# EAGLE schematic tex (EAGLE 7.7.0)

## Sheet 1 of 7: Overview
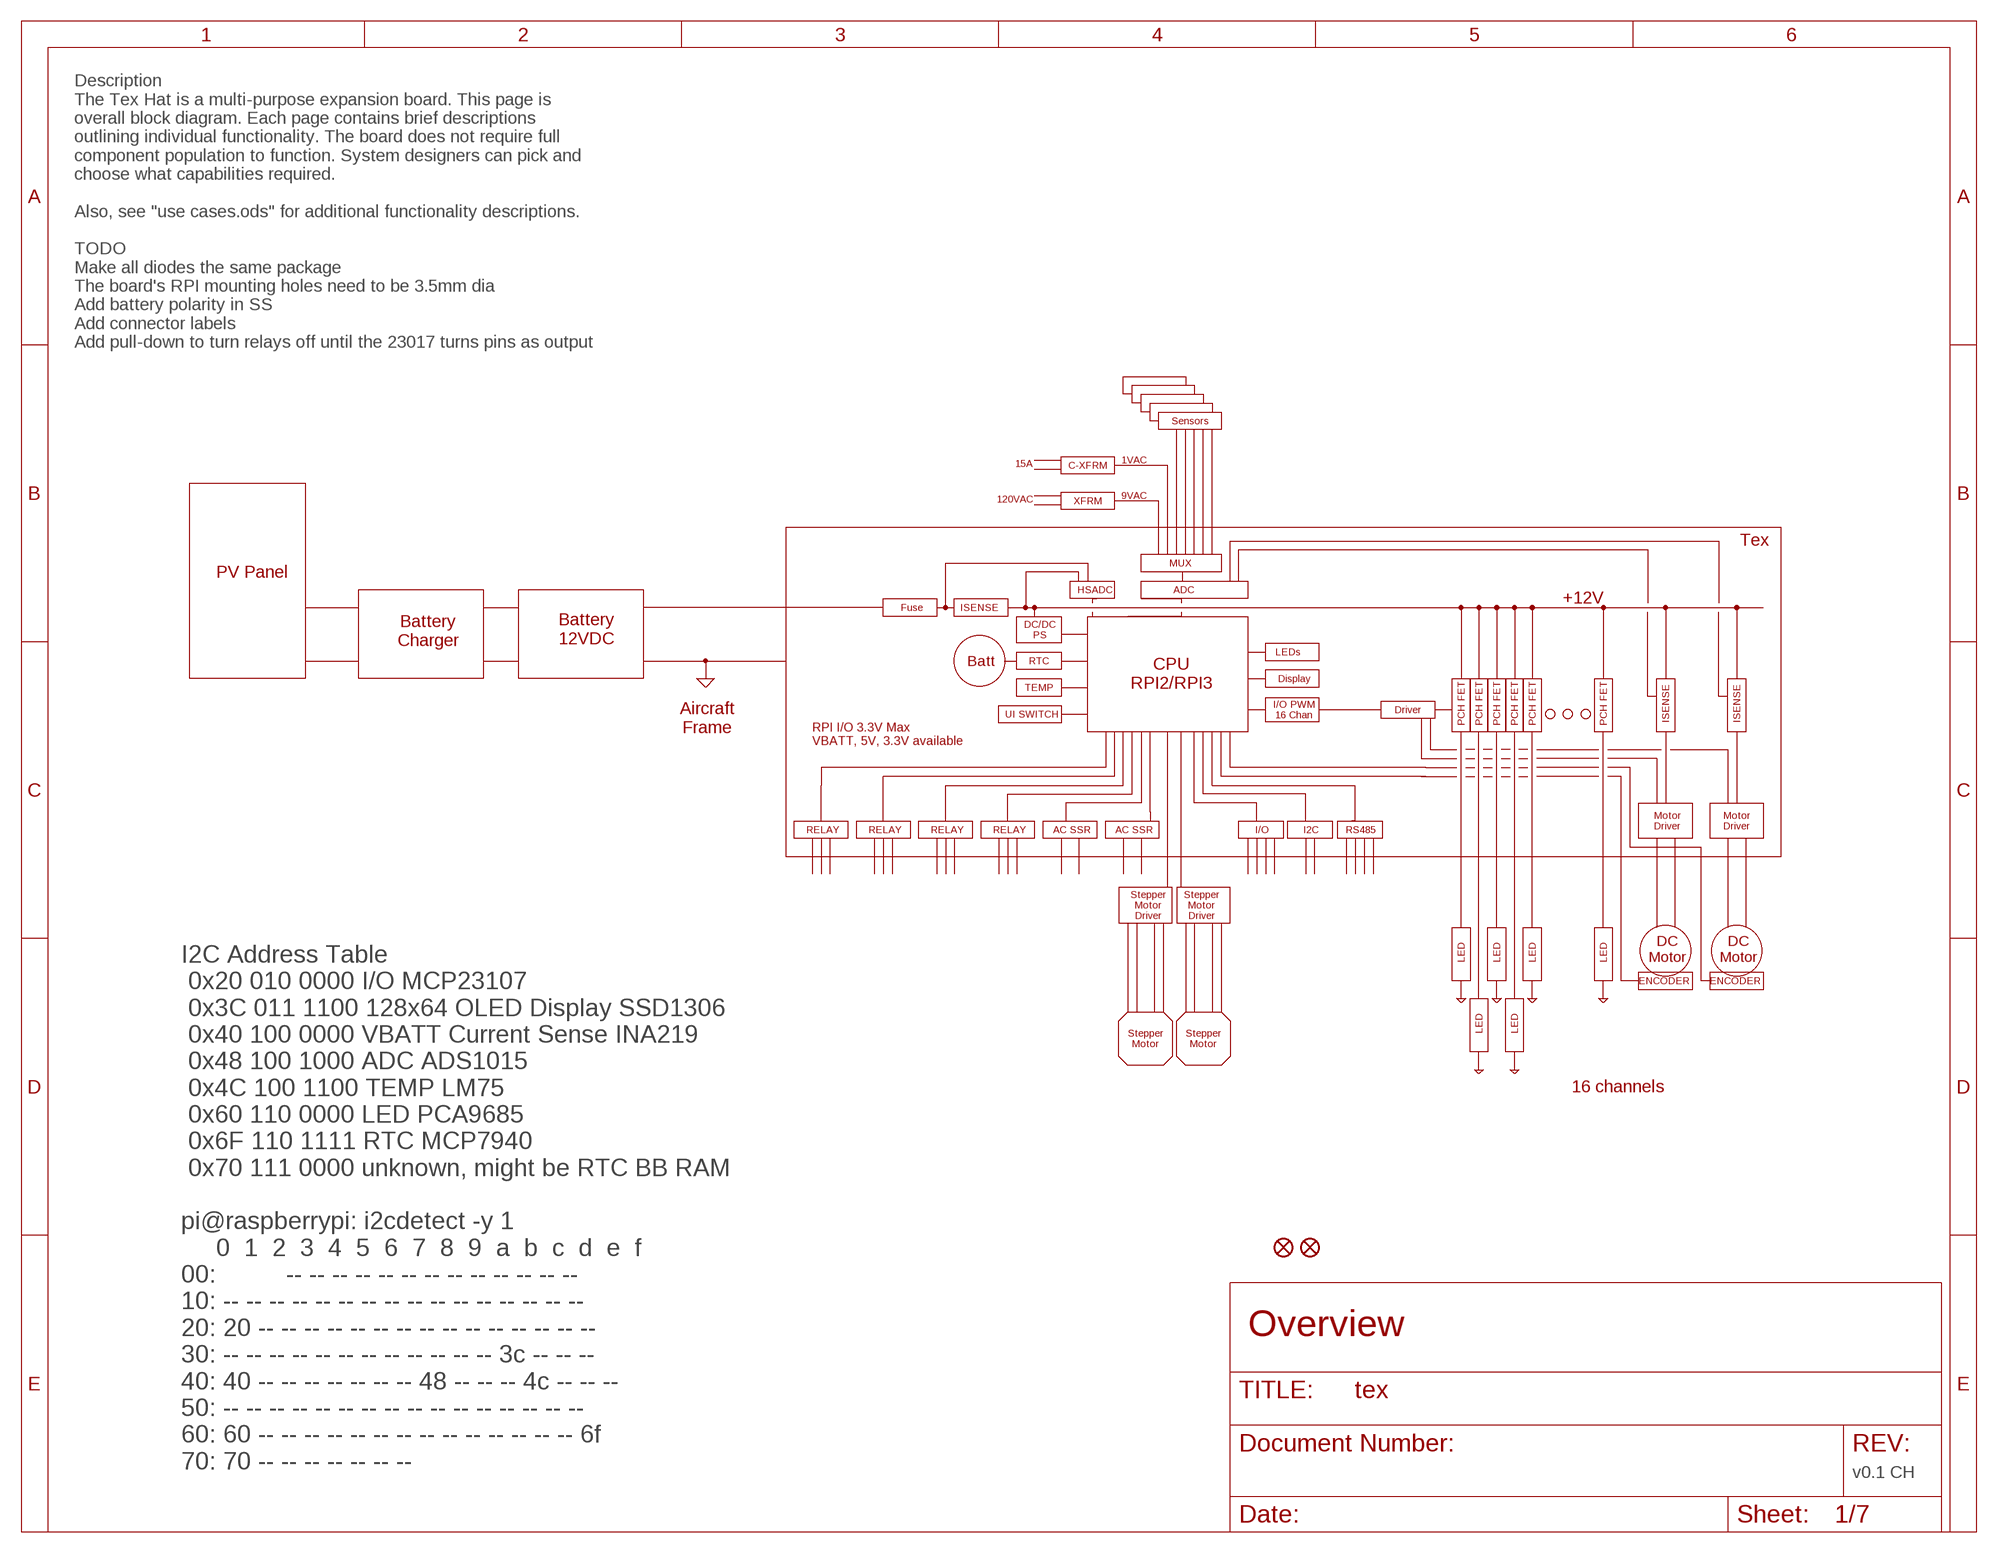
[diagram p0: schematic, sheet 1]

### Parts
JP1  FIDUCIALUFIDUCIAL  [MICRO-FIDUCIAL]
JP3  FIDUCIALUFIDUCIAL  [MICRO-FIDUCIAL]

### Notes on the sheet
- Description
  The Tex Hat is a multi-purpose expansion board. This page is
  overall block diagram. Each page contains brief descriptions 
  outlining individual functionality. The board does not require full 
  component population to function. System designers can pick and 
  choose what capabilities required.
  
  Also, see "use cases.ods" for additional functionality descriptions.
  
  TODO
  Make all diodes the same package
  The board's RPI mounting holes need to be 3.5mm dia
  Add battery polarity in SS
  Add connector labels
  Add pull-down to turn relays off until the 23017 turns pins as output
- Sensors
- 1VAC
- 15A | C-XFRM
- 9VAC
- 120VAC | XFRM
- Tex
- MUX
- PV Panel
- HSADC | ADC
- +12V
- Fuse | ISENSE
- Battery
  12VDC
- DC/DC
  PS
- Battery
  Charger
- LEDs
- Batt | RTC
- CPU
  RPI2/RPI3
- Display
- TEMP
- PCH FET | PCH FET | PCH FET | PCH FET | PCH FET | PCH FET | ISENSE | ISENSE
- I/O PWM
  16 Chan
- Driver
- UI SWITCH
- Aircraft
  Frame
- RPI I/O 3.3V Max
  VBATT, 5V, 3.3V available
- Motor
  Driver
- Motor
  Driver
- RELAY | RELAY | RELAY | RELAY | AC SSR | AC SSR | I/O | I2C | RS485
- Stepper
  Motor
  Driver
- Stepper
  Motor
  Driver
- I2C Address Table
   0x20 010 0000 I/O MCP23107
   0x3C 011 1100 128x64 OLED Display SSD1306
   0x40 100 0000 VBATT Current Sense INA219
   0x48 100 1000 ADC ADS1015
   0x4C 100 1100 TEMP LM75
   0x60 110 0000 LED PCA9685
   0x6F 110 1111 RTC MCP7940
   0x70 111 0000 unknown, might be RTC BB RAM
   
  pi@raspberrypi: i2cdetect -y 1
       0  1  2  3  4  5  6  7  8  9  a  b  c  d  e  f
  00:          -- -- -- -- -- -- -- -- -- -- -- -- -- 
  10: -- -- -- -- -- -- -- -- -- -- -- -- -- -- -- -- 
  20: 20 -- -- -- -- -- -- -- -- -- -- -- -- -- -- -- 
  30: -- -- -- -- -- -- -- -- -- -- -- -- 3c -- -- -- 
  40: 40 -- -- -- -- -- -- -- 48 -- -- -- 4c -- -- -- 
  50: -- -- -- -- -- -- -- -- -- -- -- -- -- -- -- -- 
  60: 60 -- -- -- -- -- -- -- -- -- -- -- -- -- -- 6f 
  70: 70 -- -- -- -- -- -- --
- DC
  Motor
- DC
  Motor
- LED | LED | LED | LED
- ENCODER | ENCODER
- LED | LED
- Stepper
  Motor
- Stepper
  Motor
- 16 channels
- v0.1 CH

## Sheet 2 of 7: CPU
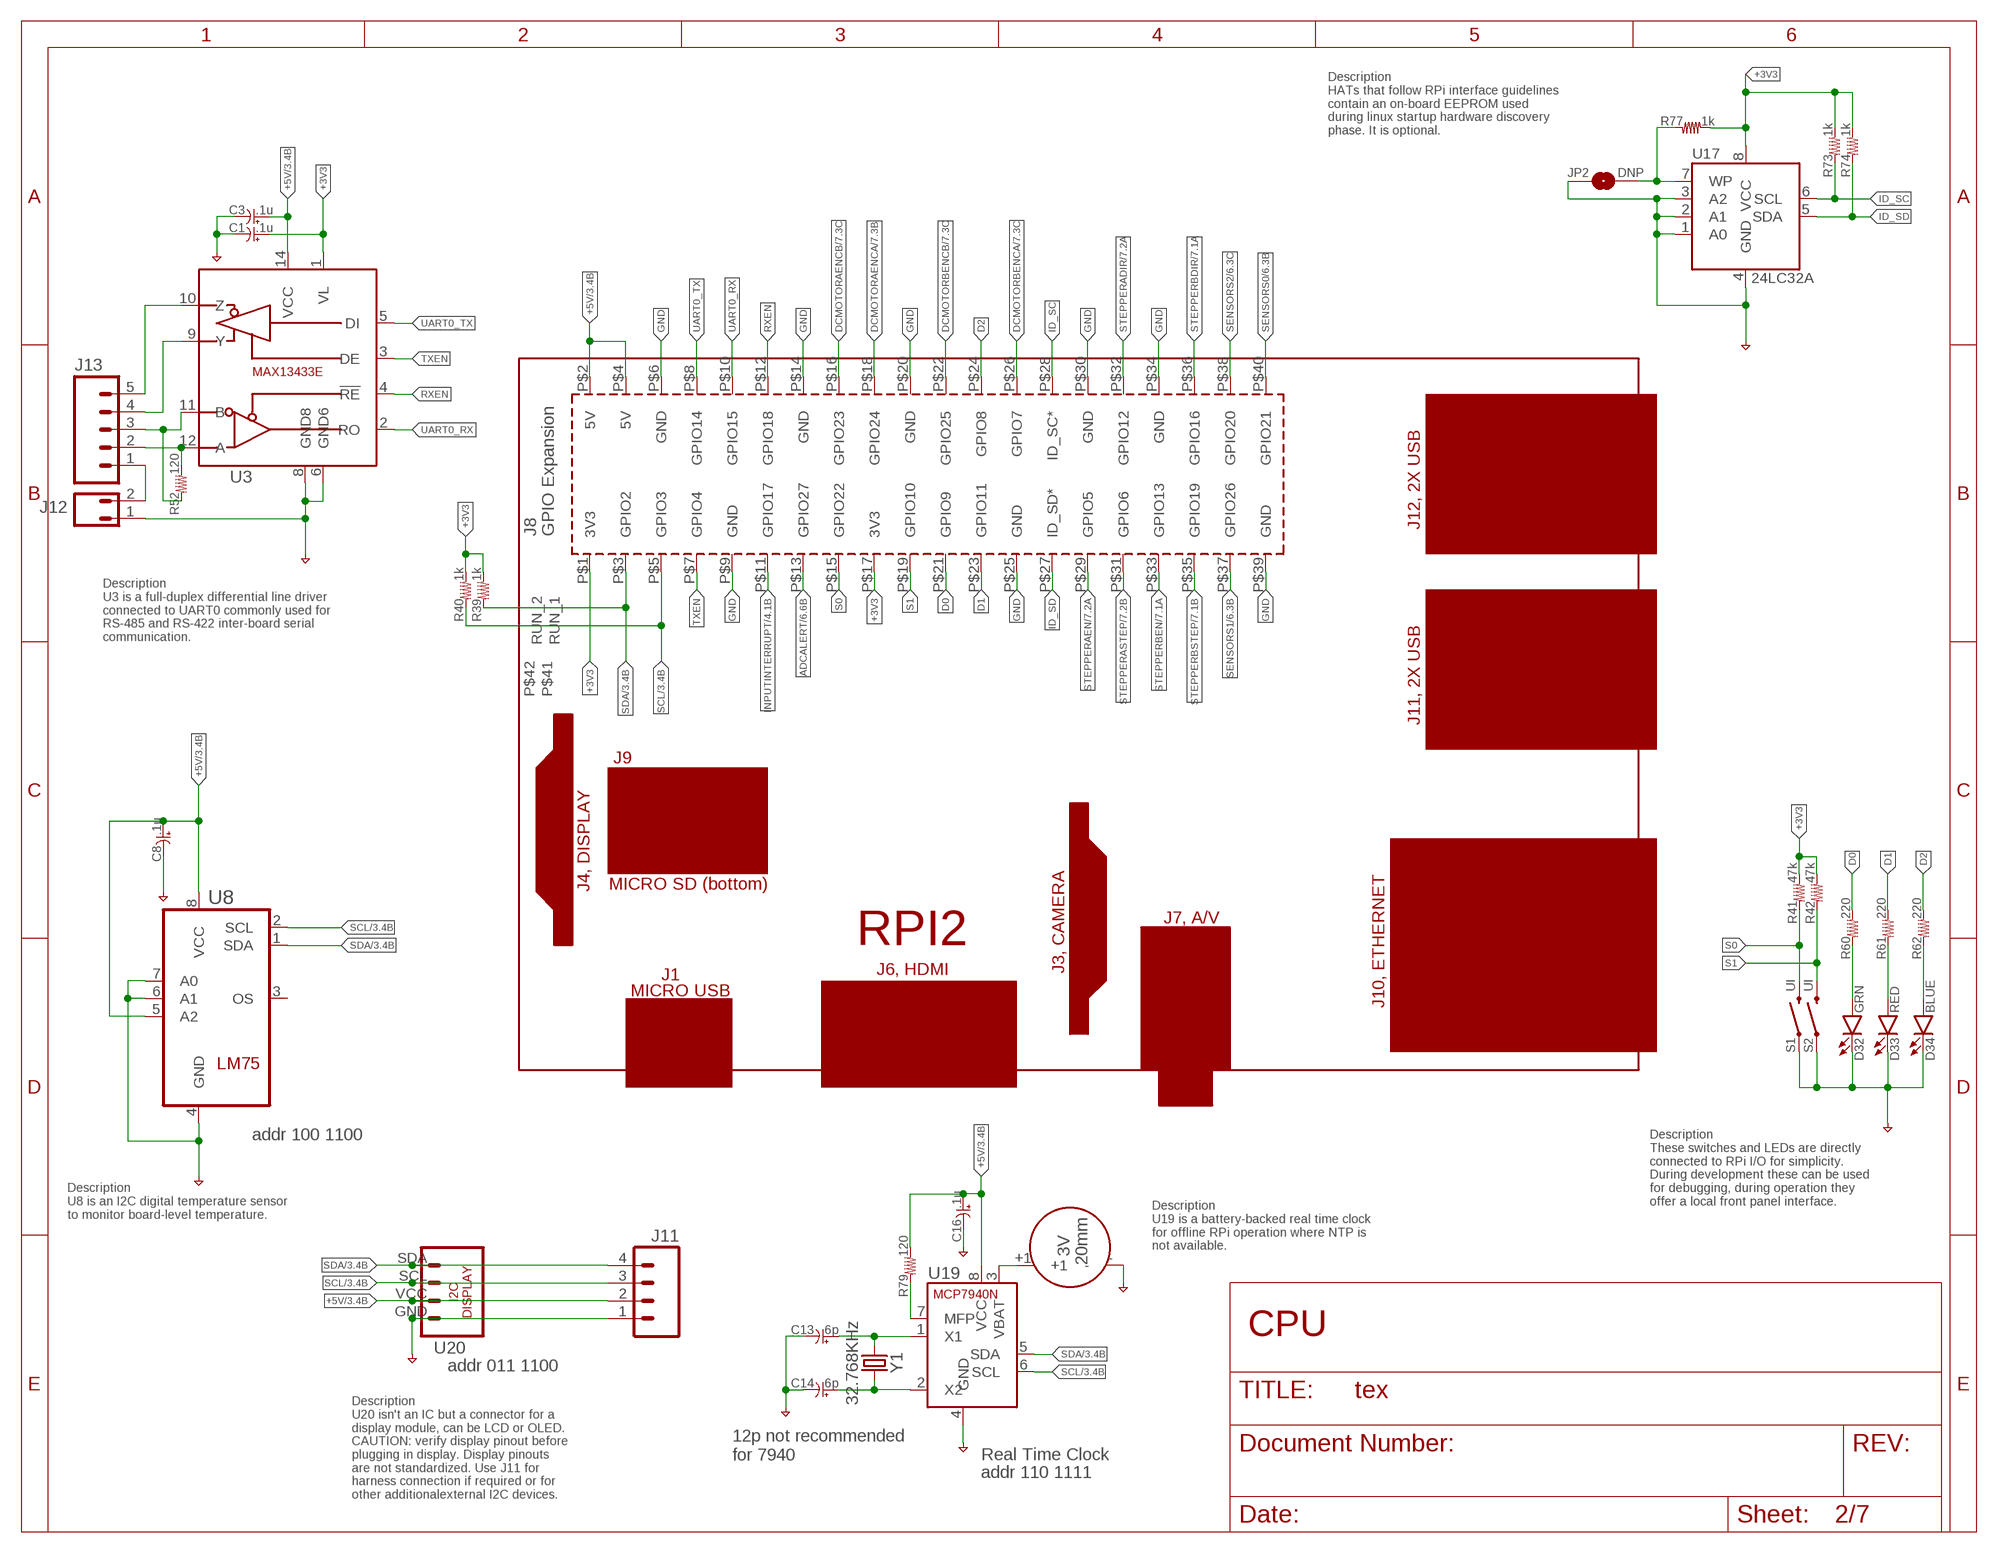
[diagram p1: schematic, sheet 2]

### Parts
B1  CR2032  CONN-COINBATTERYHOLDER-20MM  [BAT-HLD-001]
C1  .1u  C-0603  [C0603]
C3  .1u  C-0603  [C0603]
C8  .1u  C-0603  [C0603]
C13  6p  C-0603  [C0603]
C14  6p  C-0603  [C0603]
C16  .1u  C-0603  [C0603]
D32  GRN  LED-0603  [LED0603]
D33  RED  LED-0603  [LED0603]
D34  BLUE  LED-0603  [LED0603]
J11  CONN-04-0.1  [1X04]
J12  CONN-02-0.1  [1X02]
J13  CONN-05-PLUGIN-SCREW  [CONN-3.81MM-KF2EDG-5]
JP2  DNP  JUMPER-PAD-2-NO  [PAD-JUMPER-2-NO_NO_SILK]
PCB1  BOARD-RPI2  [BOARD-RPI2]
R39  1k  R-0603  [R0603]
R40  1k  R-0603  [R0603]
R41  47k  R-0603  [R0603]
R42  47k  R-0603  [R0603]
R52  120  R-0603  [R0603]
R60  220  R-0603  [R0603]
R61  220  R-0603  [R0603]
R62  220  R-0603  [R0603]
R73  1k  R-0603  [R0603]
R74  1k  R-0603  [R0603]
R77  1k  R-0603  [R0603]
R79  120  R-0603  [R0603]
S1  UI  SWITCH-PUSHBUTTON-6MMX3.5MM  [TACTILE-SWITCH-6MMX3.5MM]
S2  UI  SWITCH-PUSHBUTTON-6MMX3.5MM  [TACTILE-SWITCH-6MMX3.5MM]
U3  MAX13433E  COMM-MAX13433E  [SO14]
U8  LM75  SENSOR-TEMP-LM75-SO08  [SO08]
U17  24LC32A  MEMORY-EEPROM-SO08  [SO08]
U19  MCP7940N  RTC-MCP7940N  [SO08]
U20  DISP-I2C-4PIN  [DISP-I2C-4PIN-0.96]
Y1  32.768KHz  CRYSTAL32-SMDABS25  [ABS25]

### Nets
+3V3: C1.1 PCB1.P$1(3V3) PCB1.P$17(3V3) R39.2 R40.2 R41.2 R42.2 R73.2 R74.2 R77.2 U3.1(VL) U17.8(VCC)
+5V: C3.1 C8.1 C16.1 J11.2 PCB1.P$2(5V) PCB1.P$4(5V) R79.2 U3.14(VCC) U8.5(A2) U8.8(VCC) U19.8(VCC) U20.VCC ; also sheet 3,4,5,6,7
ADCALERT: PCB1.P$13(GPIO27) ; also sheet 6
D0: PCB1.P$21(GPIO9) R60.2
D1: PCB1.P$23(GPIO11) R61.2
D2: PCB1.P$24(GPIO8) R62.2
DCMOTORAENCA: PCB1.P$18(GPIO24) ; also sheet 7
DCMOTORAENCB: PCB1.P$16(GPIO23) ; also sheet 7
DCMOTORBENCA: PCB1.P$26(GPIO7) ; also sheet 7
DCMOTORBENCB: PCB1.P$22(GPIO25) ; also sheet 7
GND: B1.- C1.2 C3.2 C8.2 C13.2 C14.2 C16.2 D32.C D33.C D34.C J11.1 J12.1 JP2.1 PCB1.P$6(GND) PCB1.P$9(GND) PCB1.P$14(GND) PCB1.P$20(GND) PCB1.P$25(GND) PCB1.P$30(GND) PCB1.P$34(GND) PCB1.P$39(GND) S1.P$1 S2.P$1 U3.6(GND6) U3.8(GND8) U8.4(GND) U8.6(A1) U8.7(A0) U17.1(A0) U17.2(A1) U17.3(A2) U17.4(GND) U19.4(GND) U20.GND ; also sheet 3,4,5,7
ID_SC: PCB1.P$28(ID_SC*) R73.1 U17.6(SCL)
ID_SD: PCB1.P$27(ID_SD*) R74.1 U17.5(SDA)
INPUTINTERRUPT: PCB1.P$11(GPIO17) ; also sheet 4
N$3: C13.1 U19.1(X1) Y1.1
N$5: C14.1 U19.2(X2) Y1.4
N$13: J13.2 R52.2 U3.12(A)
N$14: J13.3 R52.1 U3.11(B)
N$15: J13.4 U3.9(Y)
N$16: J13.5 U3.10(Z)
N$17: J12.2 J13.1
N$29: D32.A R60.1
N$30: D33.A R61.1
N$31: D34.A R62.1
N$104: JP2.2 R77.1 U17.7(WP)
N$118: B1.+1 U19.3(VBAT)
N$192: R79.1 U19.7(MFP)
RXEN: PCB1.P$12(GPIO18) U3.4(!RE)
S0: PCB1.P$15(GPIO22) R41.1 S1.P$2
S1: PCB1.P$19(GPIO10) R42.1 S2.P$2
SCL: J11.3 PCB1.P$5(GPIO3) R40.1 U8.2(SCL) U19.6(SCL) U20.SCL ; also sheet 3,4,5,6
SDA: J11.4 PCB1.P$3(GPIO2) R39.1 U8.1(SDA) U19.5(SDA) U20.SDA ; also sheet 3,4,5,6
SENSORS0: PCB1.P$40(GPIO21) ; also sheet 6
SENSORS1: PCB1.P$37(GPIO26) ; also sheet 6
SENSORS2: PCB1.P$38(GPIO20) ; also sheet 6
STEPPERADIR: PCB1.P$32(GPIO12) ; also sheet 7
STEPPERAEN: PCB1.P$29(GPIO5) ; also sheet 7
STEPPERASTEP: PCB1.P$31(GPIO6) ; also sheet 7
STEPPERBDIR: PCB1.P$36(GPIO16) ; also sheet 7
STEPPERBEN: PCB1.P$33(GPIO13) ; also sheet 7
STEPPERBSTEP: PCB1.P$35(GPIO19) ; also sheet 7
TXEN: PCB1.P$7(GPIO4) U3.3(DE)
UART0_RX: PCB1.P$10(GPIO15) U3.2(RO)
UART0_TX: PCB1.P$8(GPIO14) U3.5(DI)
Unconnected: PCB1.P$41(RUN_1) PCB1.P$42(RUN_2) U8.3(OS)

### Notes on the sheet
- Description
  HATs that follow RPi interface guidelines 
  contain an on-board EEPROM used 
  during linux startup hardware discovery 
  phase. It is optional.
- Description
  U3 is a full-duplex differential line driver 
  connected to UART0 commonly used for 
  RS-485 and RS-422 inter-board serial 
  communication.
- Description
  These switches and LEDs are directly 
  connected to RPi I/O for simplicity. 
  During development these can be used 
  for debugging, during operation they 
  offer a local front panel interface.
- addr 100 1100
- Description
  U8 is an I2C digital temperature sensor 
  to monitor board-level temperature.
- Description
  U19 is a battery-backed real time clock 
  for offline RPi operation where NTP is
  not available.
- addr 011 1100
- Description
  U20 isn't an IC but a connector for a
  display module, can be LCD or OLED. 
  CAUTION: verify display pinout before 
  plugging in display. Display pinouts
  are not standardized. Use J11 for 
  harness connection if required or for
  other additionalexternal I2C devices.
- 12p not recommended
  for 7940
- Real Time Clock
- addr 110 1111

## Sheet 3 of 7: Power
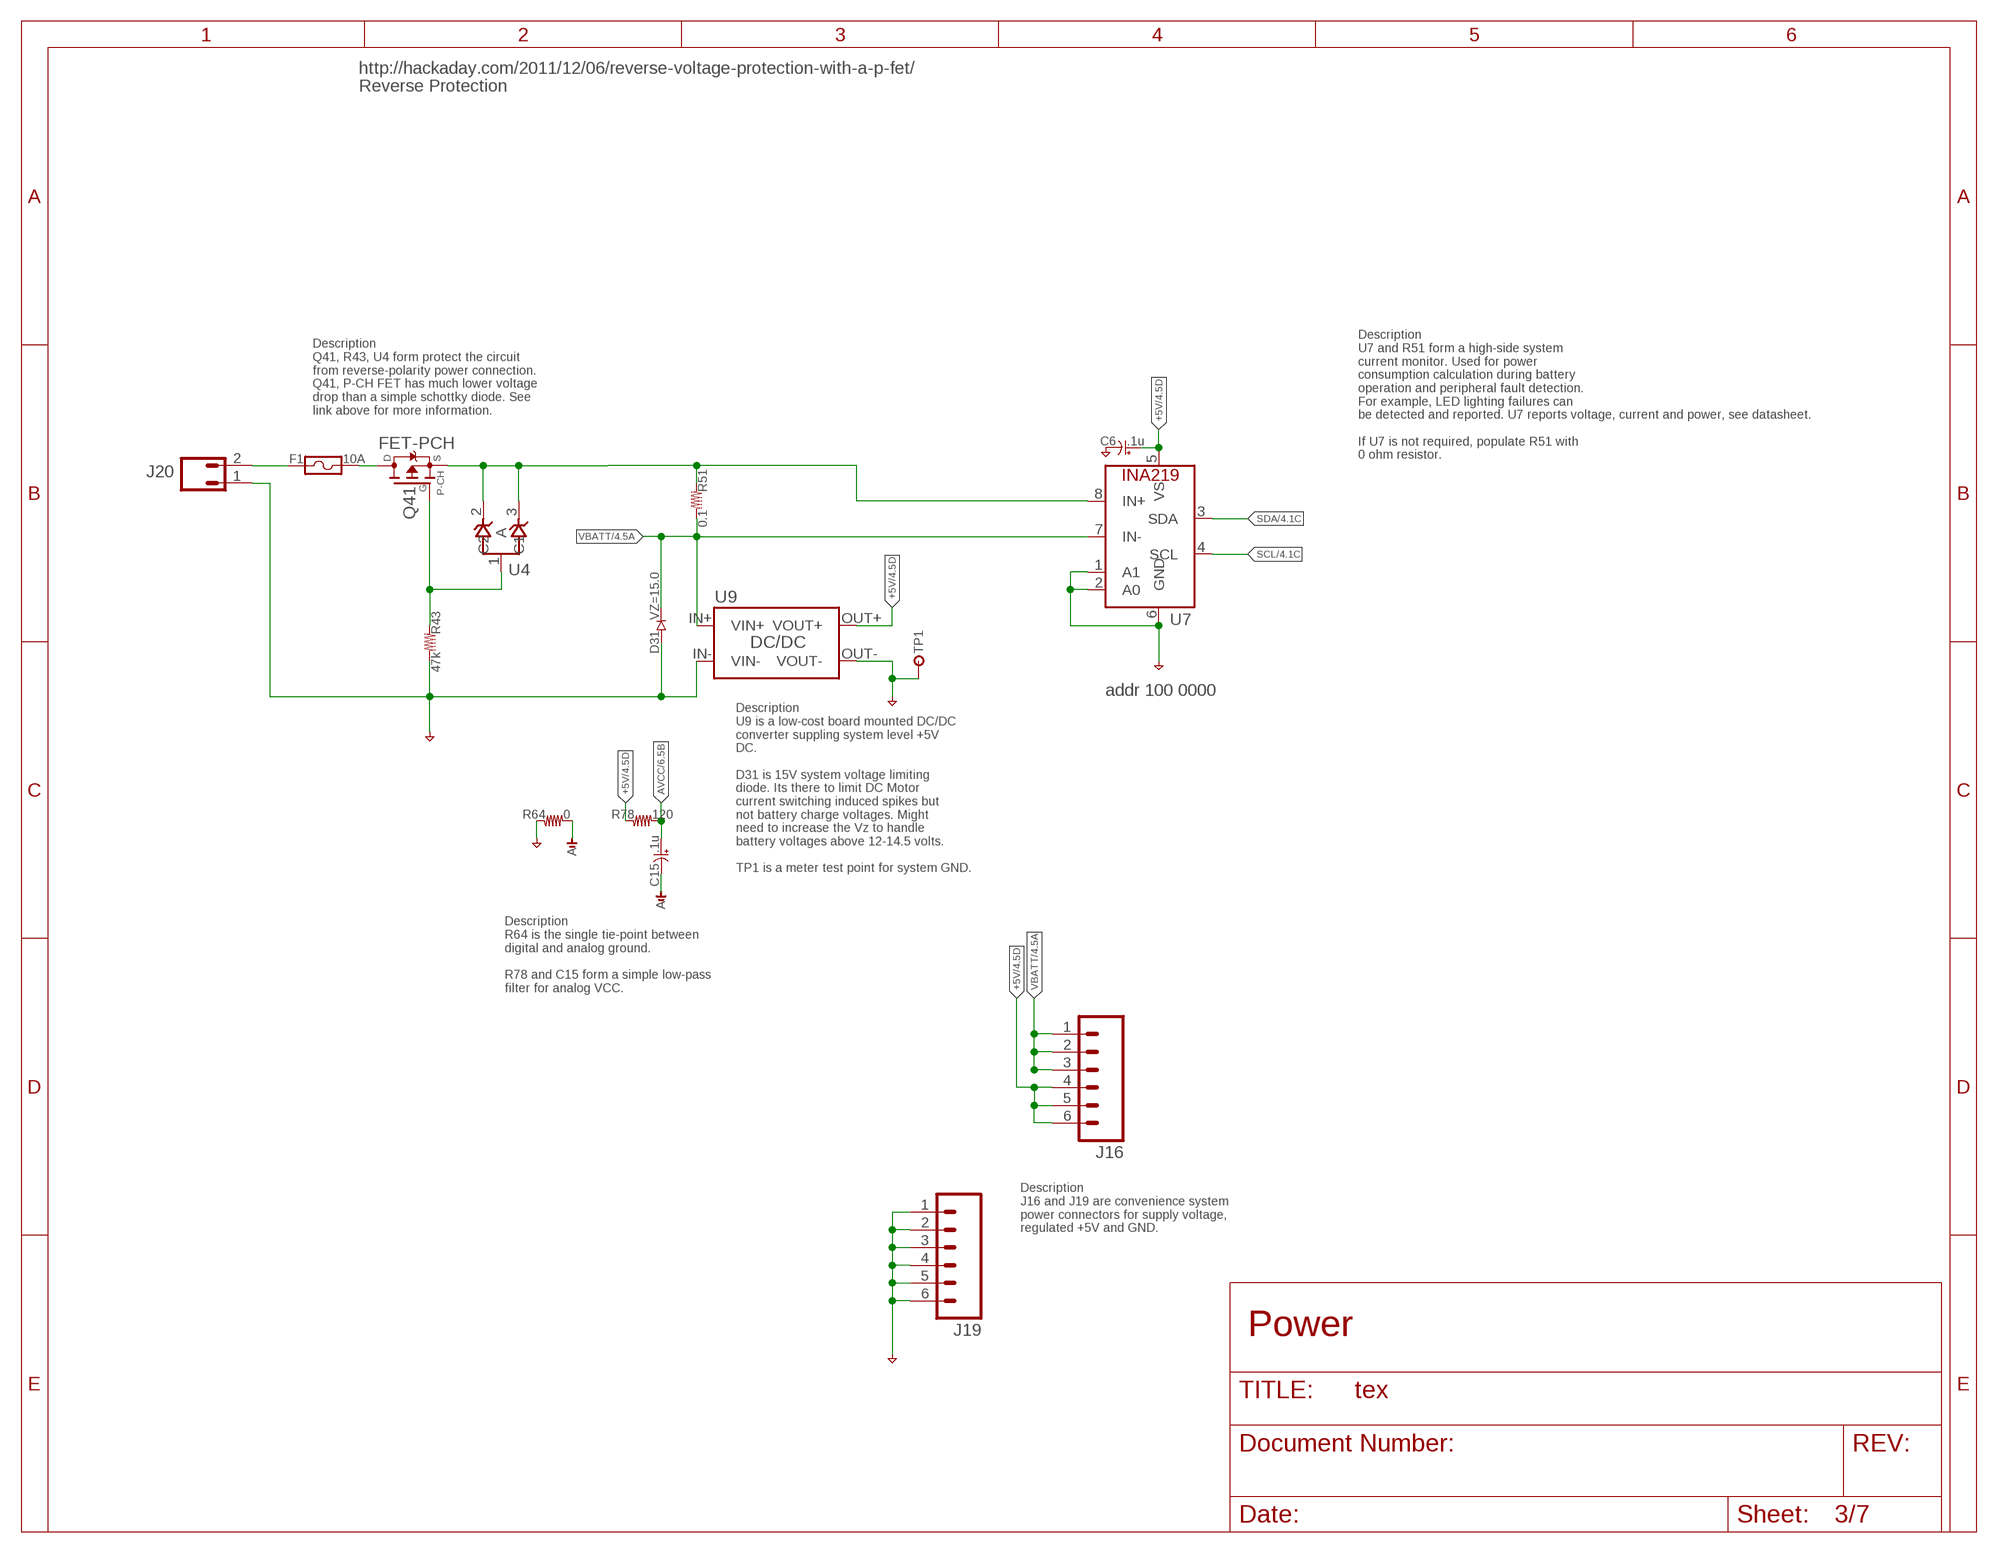
[diagram p2: schematic, sheet 3]

### Parts
C6  .1u  C-0603  [C0603]
C15  .1u  C-0603  [C0603]
D31  VZ=15.0  DIODE-SMA  [DO-214AC(SMA)]
F1  10A  FUSE-HOLDER-3557-2  [3557-2]
J16  CONN-06-PLUGIN-SCREW  [CONN-3.81MM-KF2EDG-6]
J19  CONN-06-PLUGIN-SCREW  [CONN-3.81MM-KF2EDG-6]
J20  CONN-02-6.35MM  [CONN-OSTT702]
Q41  FET-PCH  FET-PCHTO252  [TO252]
R43  47k  R-0603  [R0603]
R51  0.1  R-1210  [R1210]
R64  0  R-0603  [R0603]
R78  120  R-0603  [R0603]
TP1  TESTPOINTTHRU  [TPTHRU]
U4  AZ23C5V1  AZ23CXXX  [SOT-23]
U7  INA219  ADC-INA219-SOIC8  [SOIC8]
U9  DCDC-CONVERTER-LM2577-BOARD  [DCDC-LM2577-BOARD]

### Nets
+5V: C6.1 J16.4 J16.5 J16.6 R78.1 U7.5(VS) U9.OUT+(VOUT+) ; also sheet 2,4,5,6,7
AGND: C15.2 R64.2 ; also sheet 6,7
AVCC: C15.1 R78.2 ; also sheet 6,7
GND: C6.2 D31.A J19.1 J19.2 J19.3 J19.4 J19.5 J19.6 J20.1 R43.2 R64.1 TP1.1 U7.1(A1) U7.2(A0) U7.6(GND) U9.IN-(VIN-) U9.OUT-(VOUT-) ; also sheet 2,4,5,7
N$4: Q41.1(G) R43.1 U4.1(A)
N$101: F1.1@1 F1.1@2 J20.2
N$194: F1.2@1 F1.2@2 Q41.3(D)
SCL: U7.4(SCL) ; also sheet 2,4,5,6
SDA: U7.3(SDA) ; also sheet 2,4,5,6
VBATT: D31.C J16.1 J16.2 J16.3 R51.2 U7.7(IN-) U9.IN+(VIN+) ; also sheet 4,5,7
VBATTISENSE: Q41.2(S) R51.1 U4.2(C2) U4.3(C1) U7.8(IN+)

### Notes on the sheet
- http://hackaday.com/2011/12/06/reverse-voltage-protection-with-a-p-fet/
- Reverse Protection
- Description
  U7 and R51 form a high-side system 
  current monitor. Used for power 
  consumption calculation during battery 
  operation and peripheral fault detection. 
  For example, LED lighting failures can 
  be detected and reported. U7 reports voltage, current and power, see datasheet.
  
  If U7 is not required, populate R51 with 
  0 ohm resistor.
- Description
  Q41, R43, U4 form protect the circuit 
  from reverse-polarity power connection. 
  Q41, P-CH FET has much lower voltage 
  drop than a simple schottky diode. See
  link above for more information.
- U4
- U7
- addr 100 0000
- Description
  U9 is a low-cost board mounted DC/DC 
  converter suppling system level +5V 
  DC.
  
  D31 is 15V system voltage limiting 
  diode. Its there to limit DC Motor 
  current switching induced spikes but 
  not battery charge voltages. Might 
  need to increase the Vz to handle 
  battery voltages above 12-14.5 volts.
   
  TP1 is a meter test point for system GND.
- Description
  R64 is the single tie-point between 
  digital and analog ground.
  
  R78 and C15 form a simple low-pass 
  filter for analog VCC.
- Description
  J16 and J19 are convenience system 
  power connectors for supply voltage, 
  regulated +5V and GND.

## Sheet 4 of 7: RELAY
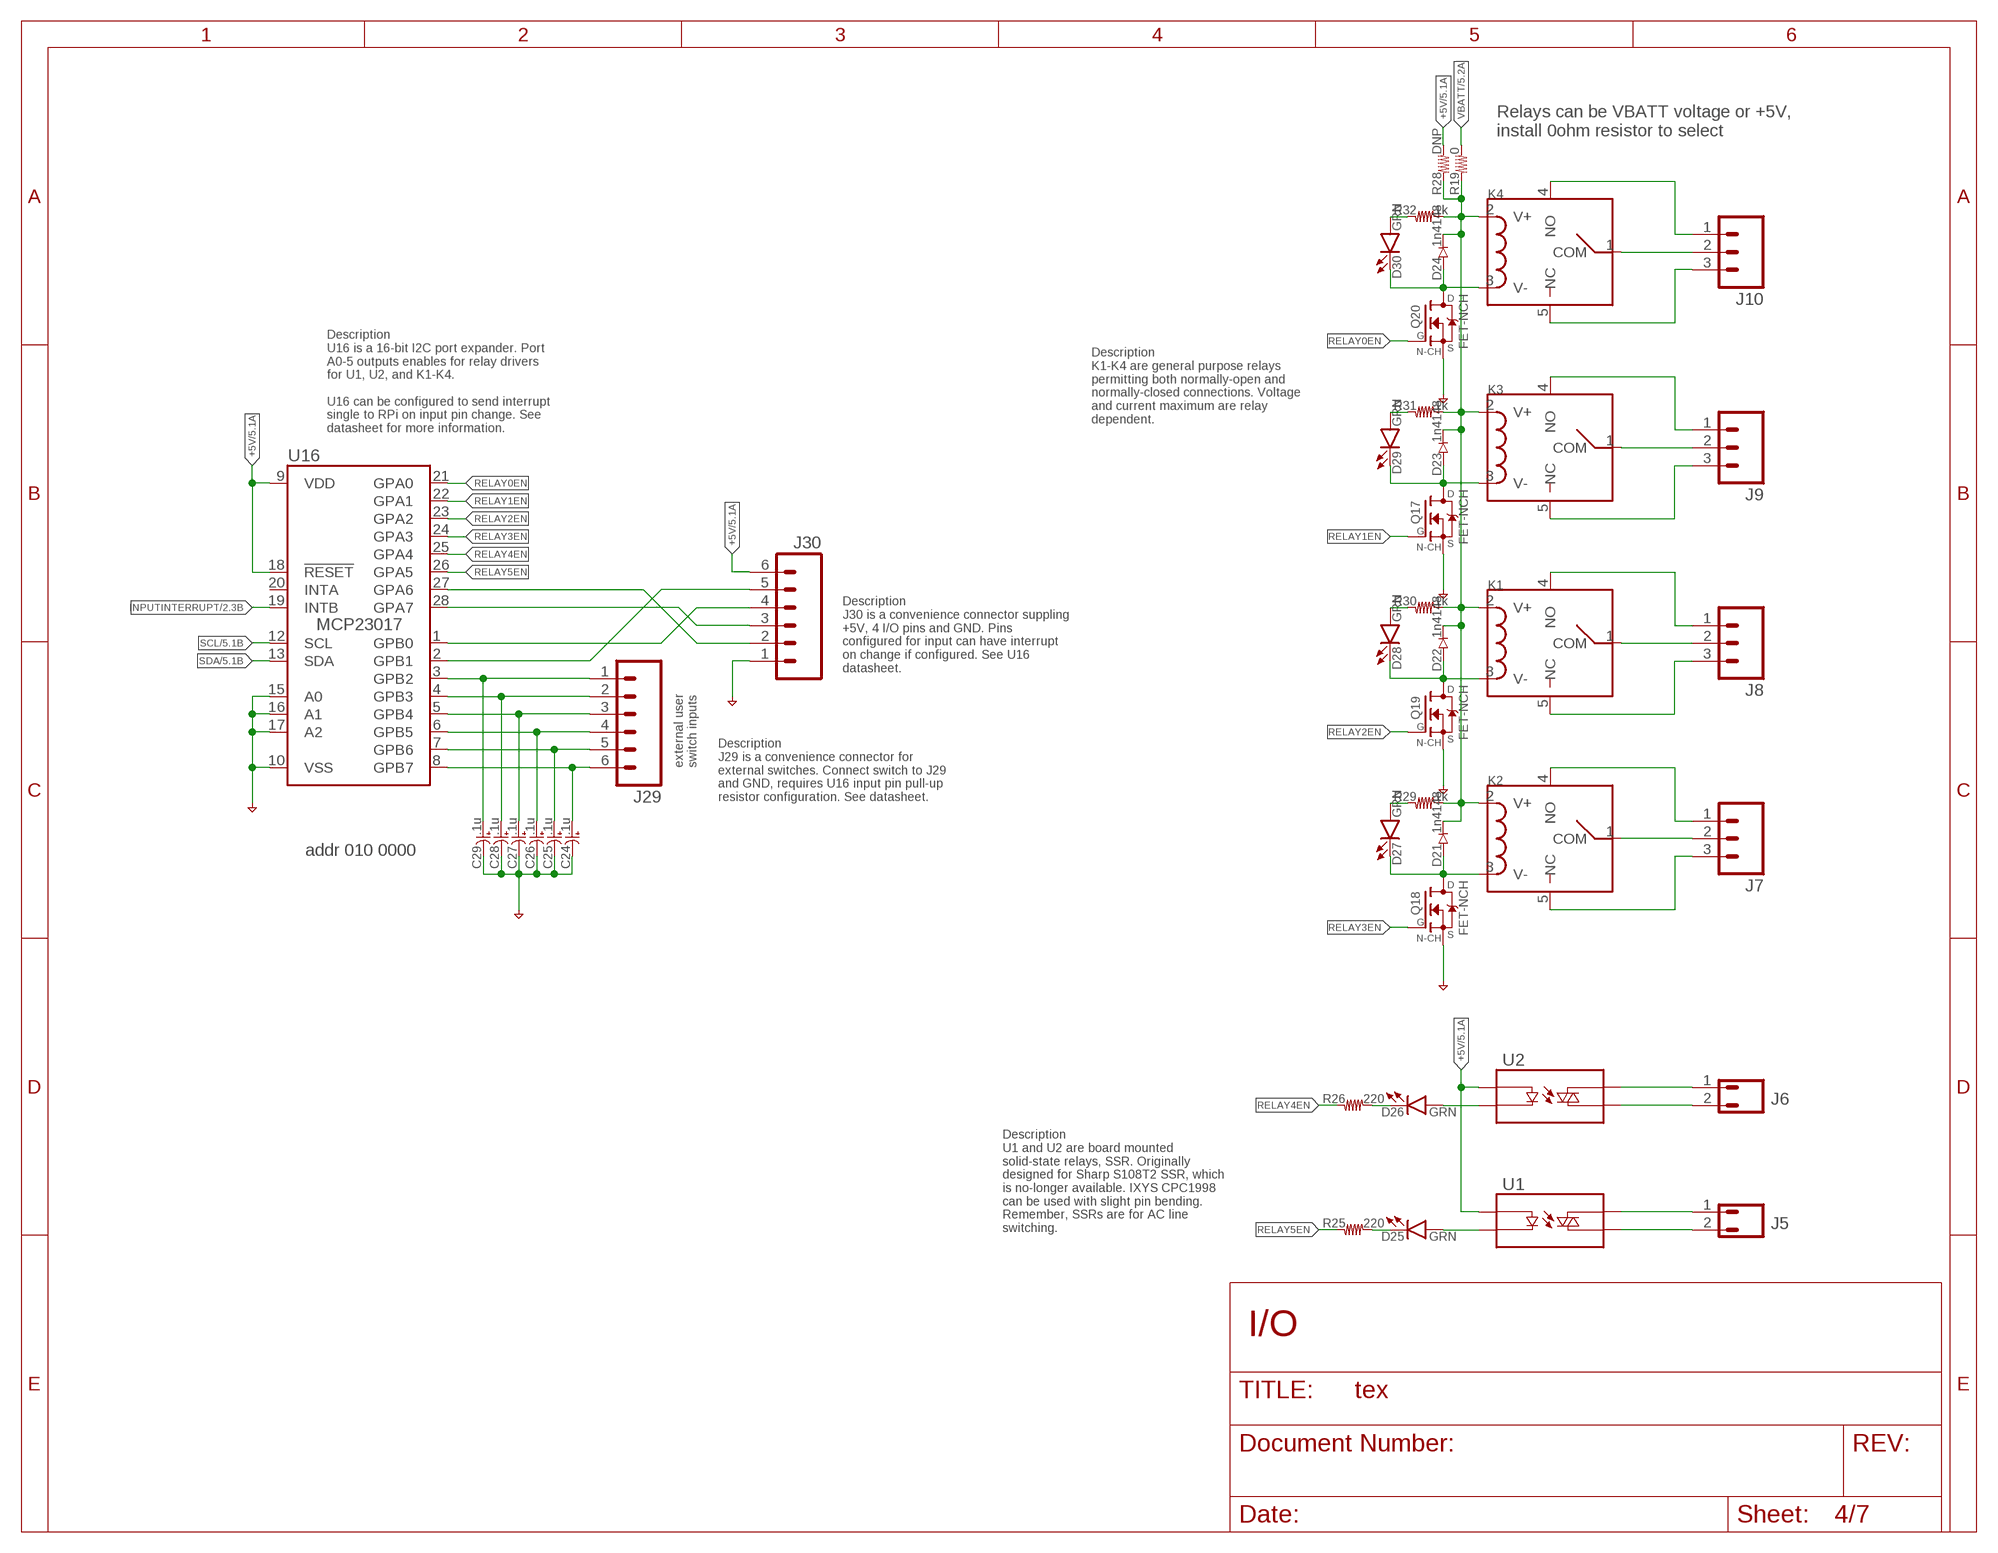
[diagram p3: schematic, sheet 4]

### Parts
C24  .1u  C-0603  [C0603]
C25  .1u  C-0603  [C0603]
C26  .1u  C-0603  [C0603]
C27  .1u  C-0603  [C0603]
C28  .1u  C-0603  [C0603]
C29  .1u  C-0603  [C0603]
D21  1n4148  DIODE-0603  [SOD-523]
D22  1n4148  DIODE-0603  [SOD-523]
D23  1n4148  DIODE-0603  [SOD-523]
D24  1n4148  DIODE-0603  [SOD-523]
D25  GRN  LED-0603  [LED0603]
D26  GRN  LED-0603  [LED0603]
D27  GRN  LED-0603  [LED0603]
D28  GRN  LED-0603  [LED0603]
D29  GRN  LED-0603  [LED0603]
D30  GRN  LED-0603  [LED0603]
J5  CONN-02-PLUGIN-SCREW  [CONN-3.81MM-KF2EDG-2]
J6  CONN-02-PLUGIN-SCREW  [CONN-3.81MM-KF2EDG-2]
J7  CONN-03-PLUGIN-SCREW  [CONN-3.81MM-KF2EDG-3]
J8  CONN-03-PLUGIN-SCREW  [CONN-3.81MM-KF2EDG-3]
J9  CONN-03-PLUGIN-SCREW  [CONN-3.81MM-KF2EDG-3]
J10  CONN-03-PLUGIN-SCREW  [CONN-3.81MM-KF2EDG-3]
J29  CONN-06-PLUGIN-SCREW  [CONN-3.81MM-KF2EDG-6]
J30  CONN-06-PLUGIN-SCREW  [CONN-3.81MM-KF2EDG-6]
K1  RELAY-SPST-19X15X15MM  [RELAY-SPST-19.0X15.0X15.0MM]
K2  RELAY-SPST-19X15X15MM  [RELAY-SPST-19.0X15.0X15.0MM]
K3  RELAY-SPST-19X15X15MM  [RELAY-SPST-19.0X15.0X15.0MM]
K4  RELAY-SPST-19X15X15MM  [RELAY-SPST-19.0X15.0X15.0MM]
Q17  FET-NCH  FET-NCHANNEL-SOT23  [SOT23-3]
Q18  FET-NCH  FET-NCHANNEL-SOT23  [SOT23-3]
Q19  FET-NCH  FET-NCHANNEL-SOT23  [SOT23-3]
Q20  FET-NCH  FET-NCHANNEL-SOT23  [SOT23-3]
R19  0  R-0603  [R0603]
R25  220  R-0603  [R0603]
R26  220  R-0603  [R0603]
R28  DNP  R-0603  [R0603]
R29  1k  R-0603  [R0603]
R30  1k  R-0603  [R0603]
R31  1k  R-0603  [R0603]
R32  1k  R-0603  [R0603]
U1  RELAY-S108T02PTH  [RELAY-S108T02]
U2  RELAY-S108T02PTH  [RELAY-S108T02]
U16  MCP23017  IO-MCP23017SO  [SO28W]

### Nets
+5V: J30.6 R28.2 U1.3(+) U2.3(+) U16.9(VDD) U16.18(!RESET) ; also sheet 2,3,5,6,7
GND: C24.2 C25.2 C26.2 C27.2 C28.2 C29.2 J30.1 Q17.2(S) Q18.2(S) Q19.2(S) Q20.2(S) U16.10(VSS) U16.15(A0) U16.16(A1) U16.17(A2) ; also sheet 2,3,5,7
GND4: D21.A D27.C K2.3(V-) Q18.3(D)
INPUTINTERRUPT: U16.19(INTB) ; also sheet 2
N$6: J30.2 U16.27(GPA6)
N$7: J30.5 U16.2(GPB1)
N$8: J30.4 U16.1(GPB0)
N$9: J30.3 U16.28(GPA7)
N$76: J6.1 U2.1(T1)
N$102: C29.1 J29.1 U16.3(GPB2)
N$103: C28.1 J29.2 U16.4(GPB3)
N$108: C27.1 J29.3 U16.5(GPB4)
N$109: C26.1 J29.4 U16.6(GPB5)
N$111: C25.1 J29.5 U16.7(GPB6)
N$114: C24.1 J29.6 U16.8(GPB7)
N$143: J10.2 K4.1(COM)
N$144: J10.1 K4.4(NO)
N$145: J10.3 K4.5(NC)
N$147: D29.A R31.1
N$159: D22.A D28.C K1.3(V-) Q19.3(D)
N$161: D23.A D29.C K3.3(V-) Q17.3(D)
N$163: J9.2 K3.1(COM)
N$164: J9.1 K3.4(NO)
N$165: J9.3 K3.5(NC)
N$166: J8.2 K1.1(COM)
N$167: J8.1 K1.4(NO)
N$168: J8.3 K1.5(NC)
N$169: J7.1 K2.4(NO)
N$170: J7.2 K2.1(COM)
N$171: J7.3 K2.5(NC)
N$172: D21.C D22.C D23.C D24.C K1.2(V+) K2.2(V+) K3.2(V+) K4.2(V+) R19.1 R28.1 R29.2 R30.2 R31.2 R32.2
N$173: D30.A R32.1
N$174: D28.A R30.1
N$175: D27.A R29.1
N$176: D24.A D30.C K4.3(V-) Q20.3(D)
N$177: J6.2 U2.2(T2)
N$178: J5.1 U1.1(T1)
N$179: J5.2 U1.2(T2)
N$180: D26.C R26.2
N$181: D25.C R25.2
N$182: D26.A U2.4(-)
N$183: D25.A U1.4(-)
RELAY0EN: Q20.1(G) U16.21(GPA0)
RELAY1EN: Q17.1(G) U16.22(GPA1)
RELAY2EN: Q19.1(G) U16.23(GPA2)
RELAY3EN: Q18.1(G) U16.24(GPA3)
RELAY4EN: R26.1 U16.25(GPA4)
RELAY5EN: R25.1 U16.26(GPA5)
SCL: U16.12(SCL) ; also sheet 2,3,5,6
SDA: U16.13(SDA) ; also sheet 2,3,5,6
VBATT: R19.2 ; also sheet 3,5,7
Unconnected: U16.20(INTA)

### Notes on the sheet
- Relays can be VBATT voltage or +5V,
  install 0ohm resistor to select
- Description
  U16 is a 16-bit I2C port expander. Port 
  A0-5 outputs enables for relay drivers 
  for U1, U2, and K1-K4.
  
  U16 can be configured to send interrupt 
  single to RPi on input pin change. See 
  datasheet for more information.
- Description
  K1-K4 are general purpose relays 
  permitting both normally-open and 
  normally-closed connections. Voltage 
  and current maximum are relay 
  dependent.
- Description
  J30 is a convenience connector suppling 
  +5V, 4 I/O pins and GND. Pins 
  configured for input can have interrupt 
  on change if configured. See U16 
  datasheet.
- Description
  J29 is a convenience connector for 
  external switches. Connect switch to J29 
  and GND, requires U16 input pin pull-up 
  resistor configuration. See datasheet.
- external user
  switch inputs
- addr 010 0000
- Description
  U1 and U2 are board mounted 
  solid-state relays, SSR. Originally 
  designed for Sharp S108T2 SSR, which 
  is no-longer available. IXYS CPC1998 
  can be used with slight pin bending. 
  Remember, SSRs are for AC line 
  switching.

## Sheet 5 of 7: LED
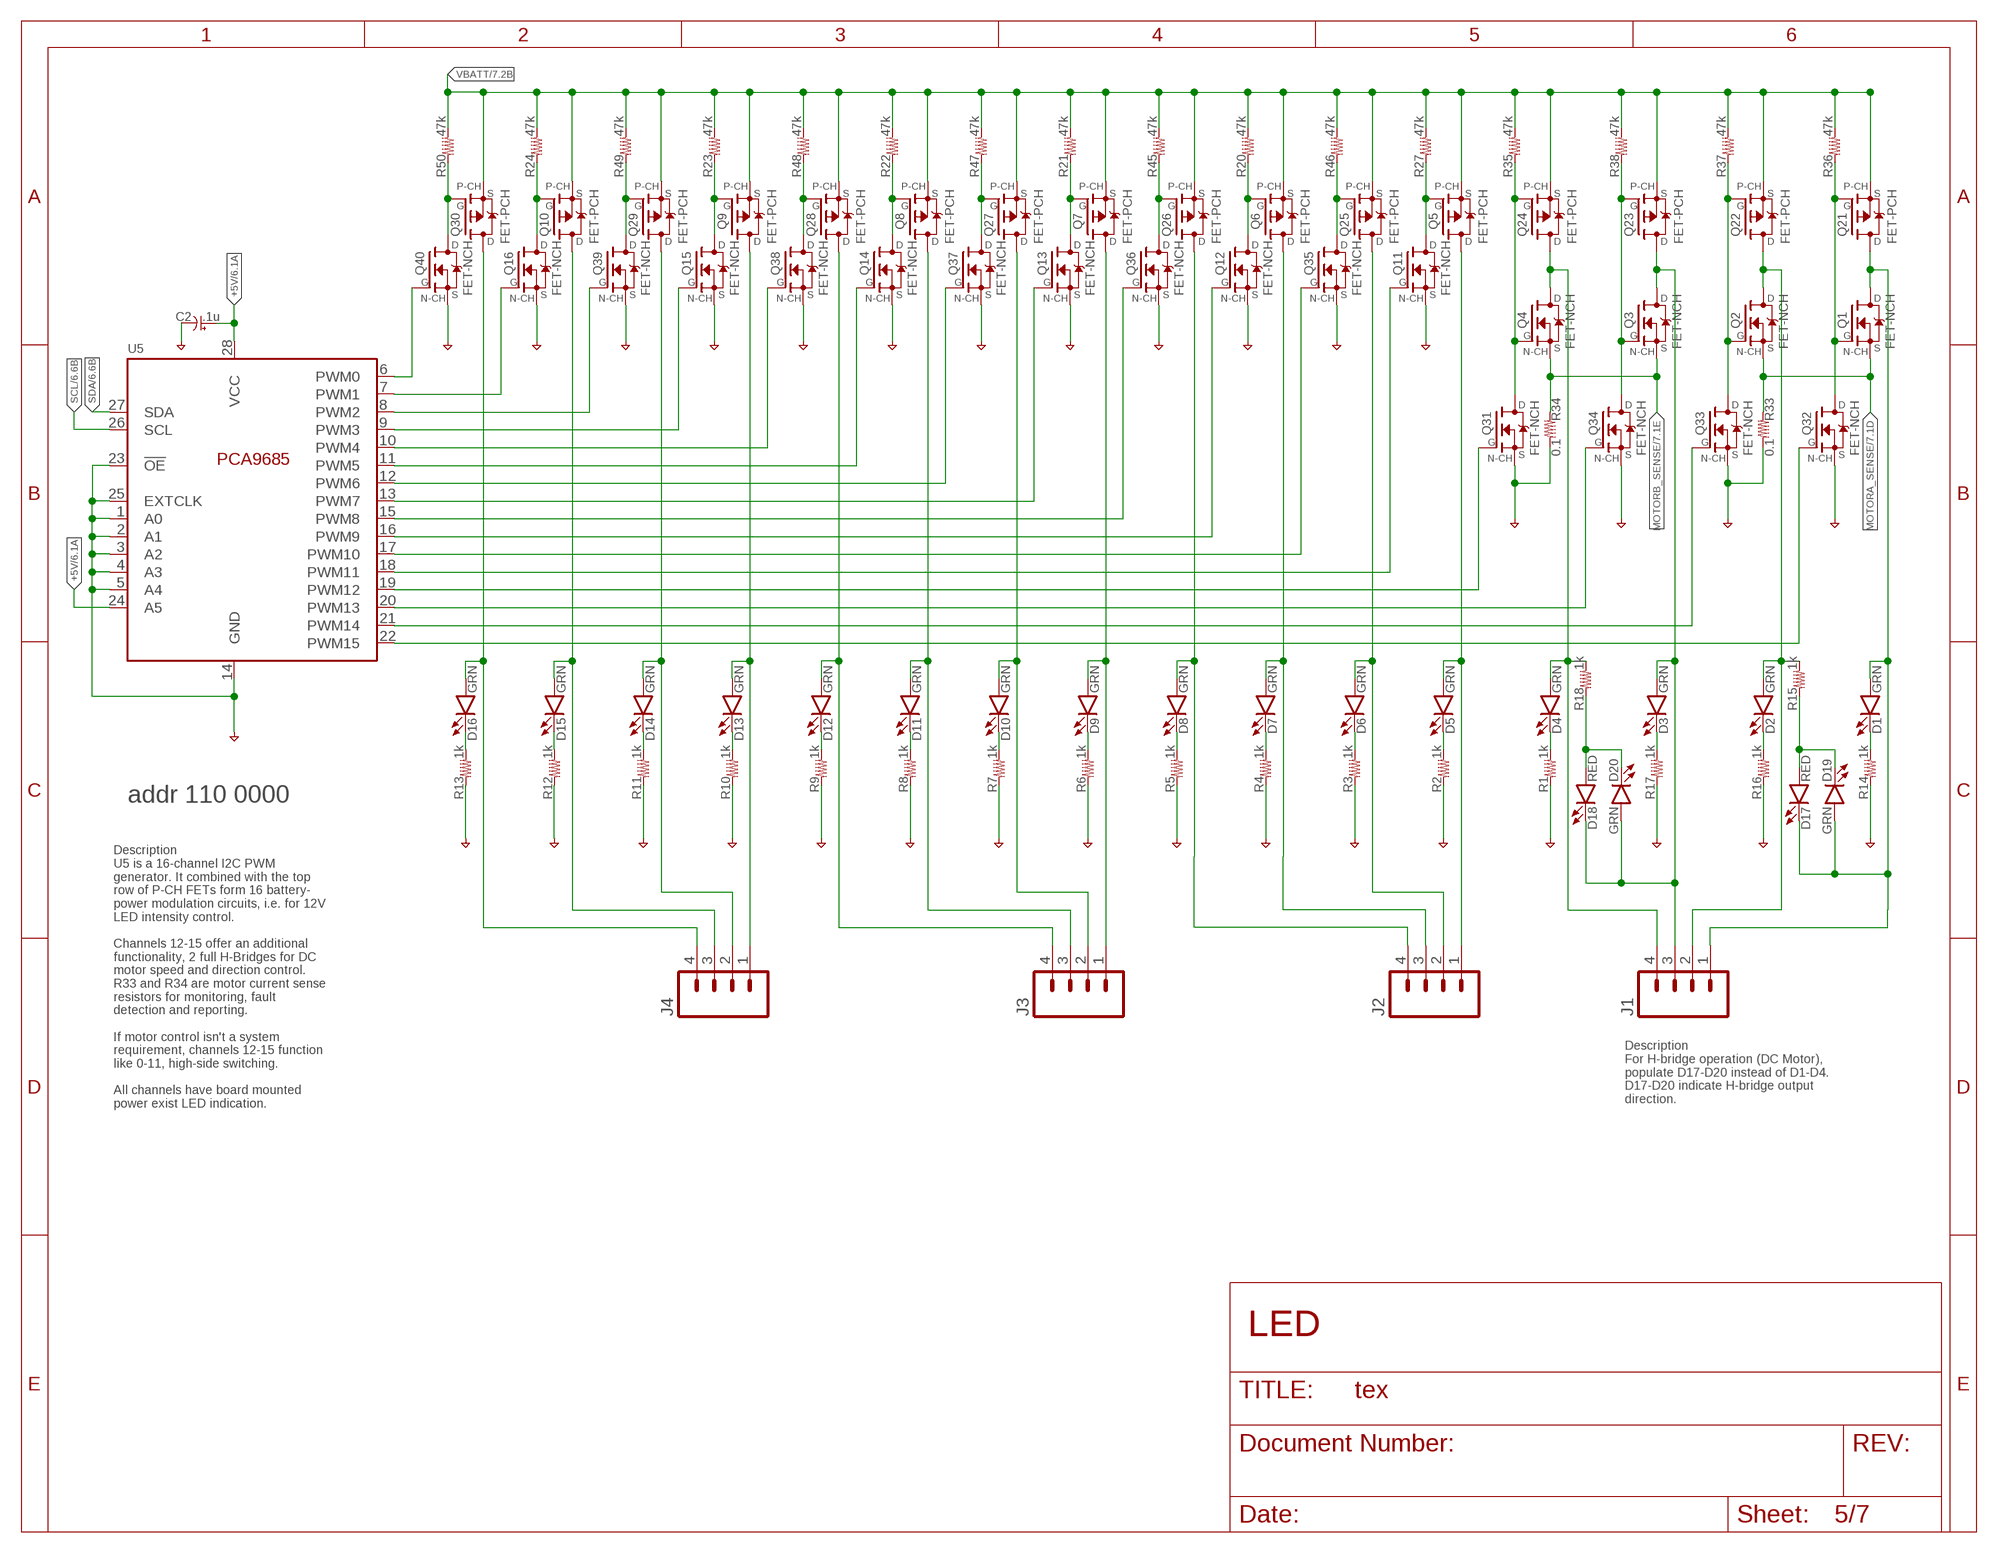
[diagram p4: schematic, sheet 5]

### Parts
C2  .1u  C-0603  [C0603]
D1  GRN  LED-0603  [LED0603]
D2  GRN  LED-0603  [LED0603]
D3  GRN  LED-0603  [LED0603]
D4  GRN  LED-0603  [LED0603]
D5  GRN  LED-0603  [LED0603]
D6  GRN  LED-0603  [LED0603]
D7  GRN  LED-0603  [LED0603]
D8  GRN  LED-0603  [LED0603]
D9  GRN  LED-0603  [LED0603]
D10  GRN  LED-0603  [LED0603]
D11  GRN  LED-0603  [LED0603]
D12  GRN  LED-0603  [LED0603]
D13  GRN  LED-0603  [LED0603]
D14  GRN  LED-0603  [LED0603]
D15  GRN  LED-0603  [LED0603]
D16  GRN  LED-0603  [LED0603]
D17  RED  LED-0603  [LED0603]
D18  RED  LED-0603  [LED0603]
D19  GRN  LED-0603  [LED0603]
D20  GRN  LED-0603  [LED0603]
J1  CONN-04-PLUGIN-SCREW  [CONN-3.81MM-KF2EDG-4]
J2  CONN-04-PLUGIN-SCREW  [CONN-3.81MM-KF2EDG-4]
J3  CONN-04-PLUGIN-SCREW  [CONN-3.81MM-KF2EDG-4]
J4  CONN-04-PLUGIN-SCREW  [CONN-3.81MM-KF2EDG-4]
Q1  FET-NCH  FET-NCHANNEL-TO252  [TO252]
Q2  FET-NCH  FET-NCHANNEL-TO252  [TO252]
Q3  FET-NCH  FET-NCHANNEL-TO252  [TO252]
Q4  FET-NCH  FET-NCHANNEL-TO252  [TO252]
Q5  FET-PCH  FET-PCHANNEL-TO252  [TO252]
Q6  FET-PCH  FET-PCHANNEL-TO252  [TO252]
Q7  FET-PCH  FET-PCHANNEL-TO252  [TO252]
Q8  FET-PCH  FET-PCHANNEL-TO252  [TO252]
Q9  FET-PCH  FET-PCHANNEL-TO252  [TO252]
Q10  FET-PCH  FET-PCHANNEL-TO252  [TO252]
Q11  FET-NCH  FET-NCHANNEL-SOT23  [SOT23-3]
Q12  FET-NCH  FET-NCHANNEL-SOT23  [SOT23-3]
Q13  FET-NCH  FET-NCHANNEL-SOT23  [SOT23-3]
Q14  FET-NCH  FET-NCHANNEL-SOT23  [SOT23-3]
Q15  FET-NCH  FET-NCHANNEL-SOT23  [SOT23-3]
Q16  FET-NCH  FET-NCHANNEL-SOT23  [SOT23-3]
Q21  FET-PCH  FET-PCHANNEL-TO252  [TO252]
Q22  FET-PCH  FET-PCHANNEL-TO252  [TO252]
Q23  FET-PCH  FET-PCHANNEL-TO252  [TO252]
Q24  FET-PCH  FET-PCHANNEL-TO252  [TO252]
Q25  FET-PCH  FET-PCHANNEL-TO252  [TO252]
Q26  FET-PCH  FET-PCHANNEL-TO252  [TO252]
Q27  FET-PCH  FET-PCHANNEL-TO252  [TO252]
Q28  FET-PCH  FET-PCHANNEL-TO252  [TO252]
Q29  FET-PCH  FET-PCHANNEL-TO252  [TO252]
Q30  FET-PCH  FET-PCHANNEL-TO252  [TO252]
Q31  FET-NCH  FET-NCHANNEL-SOT23  [SOT23-3]
Q32  FET-NCH  FET-NCHANNEL-SOT23  [SOT23-3]
Q33  FET-NCH  FET-NCHANNEL-SOT23  [SOT23-3]
Q34  FET-NCH  FET-NCHANNEL-SOT23  [SOT23-3]
Q35  FET-NCH  FET-NCHANNEL-SOT23  [SOT23-3]
Q36  FET-NCH  FET-NCHANNEL-SOT23  [SOT23-3]
Q37  FET-NCH  FET-NCHANNEL-SOT23  [SOT23-3]
Q38  FET-NCH  FET-NCHANNEL-SOT23  [SOT23-3]
Q39  FET-NCH  FET-NCHANNEL-SOT23  [SOT23-3]
Q40  FET-NCH  FET-NCHANNEL-SOT23  [SOT23-3]
R1  1k  R-0603  [R0603]
R2  1k  R-0603  [R0603]
R3  1k  R-0603  [R0603]
R4  1k  R-0603  [R0603]
R5  1k  R-0603  [R0603]
R6  1k  R-0603  [R0603]
R7  1k  R-0603  [R0603]
R8  1k  R-0603  [R0603]
R9  1k  R-0603  [R0603]
R10  1k  R-0603  [R0603]
R11  1k  R-0603  [R0603]
R12  1k  R-0603  [R0603]
R13  1k  R-0603  [R0603]
R14  1k  R-0603  [R0603]
R15  1k  R-0603  [R0603]
R16  1k  R-0603  [R0603]
R17  1k  R-0603  [R0603]
R18  1k  R-0603  [R0603]
R20  47k  R-0603  [R0603]
R21  47k  R-0603  [R0603]
R22  47k  R-0603  [R0603]
R23  47k  R-0603  [R0603]
R24  47k  R-0603  [R0603]
R27  47k  R-0603  [R0603]
R33  0.1  R-1210  [R1210]
R34  0.1  R-1210  [R1210]
R35  47k  R-0603  [R0603]
R36  47k  R-0603  [R0603]
R37  47k  R-0603  [R0603]
R38  47k  R-0603  [R0603]
R45  47k  R-0603  [R0603]
R46  47k  R-0603  [R0603]
R47  47k  R-0603  [R0603]
R48  47k  R-0603  [R0603]
R49  47k  R-0603  [R0603]
R50  47k  R-0603  [R0603]
U5  PCA9685  IO-PCA9685-TSSOP28  [TSSOP28]

### Nets
+5V: C2.1 U5.24(A5) U5.28(VCC) ; also sheet 2,3,4,6,7
GND: C2.2 Q11.2(S) Q12.2(S) Q13.2(S) Q14.2(S) Q15.2(S) Q16.2(S) Q31.2(S) Q32.2(S) Q33.2(S) Q34.2(S) Q35.2(S) Q36.2(S) Q37.2(S) Q38.2(S) Q39.2(S) Q40.2(S) R1.1 R2.1 R3.1 R4.1 R5.1 R6.1 R7.1 R8.1 R9.1 R10.1 R11.1 R12.1 R13.1 R14.1 R16.1 R17.1 R33.2 R34.2 U5.1(A0) U5.2(A1) U5.3(A2) U5.4(A3) U5.5(A4) U5.14(GND) U5.23(!OE) U5.25(EXTCLK) ; also sheet 2,3,4,7
MOTORA_SENSE: Q1.2(S) Q2.2(S) R33.1 ; also sheet 7
MOTORB_SENSE: Q3.2(S) Q4.2(S) R34.1 ; also sheet 7
N$1: Q40.1(G) U5.6(PWM0)
N$35: Q6.1(G) Q12.3(D) R20.1
N$36: Q26.1(G) Q36.3(D) R45.1
N$37: Q7.1(G) Q13.3(D) R21.1
N$40: Q27.1(G) Q37.3(D) R47.1
N$41: Q8.1(G) Q14.3(D) R22.1
N$42: Q28.1(G) Q38.3(D) R48.1
N$43: Q9.1(G) Q15.3(D) R23.1
N$44: Q29.1(G) Q39.3(D) R49.1
N$45: Q10.1(G) Q16.3(D) R24.1
N$46: Q30.1(G) Q40.3(D) R50.1
N$47: Q16.1(G) U5.7(PWM1)
N$48: Q39.1(G) U5.8(PWM2)
N$49: Q15.1(G) U5.9(PWM3)
N$50: Q38.1(G) U5.10(PWM4)
N$51: Q14.1(G) U5.11(PWM5)
N$52: Q37.1(G) U5.12(PWM6)
N$53: Q13.1(G) U5.13(PWM7)
N$54: Q36.1(G) U5.15(PWM8)
N$56: Q12.1(G) U5.16(PWM9)
N$57: D2.A J1.2 Q2.3(D) Q22.3(D) R15.2
N$58: Q2.1(G) Q22.1(G) Q33.3(D) R37.1
N$59: D1.A D17.C D19.A J1.1 Q1.3(D) Q21.3(D)
N$60: Q1.1(G) Q21.1(G) Q32.3(D) R36.1
N$61: Q32.1(G) U5.22(PWM15)
N$62: Q33.1(G) U5.21(PWM14)
N$63: D4.A J1.4 Q4.3(D) Q24.3(D) R18.2
N$64: Q4.1(G) Q24.1(G) Q31.3(D) R35.1
N$65: D16.A J4.4 Q30.3(D)
N$66: D15.A J4.3 Q10.3(D)
N$67: D14.A J4.2 Q29.3(D)
N$68: D13.A J4.1 Q9.3(D)
N$69: D12.A J3.4 Q28.3(D)
N$70: D11.A J3.3 Q8.3(D)
N$71: D10.A J3.2 Q27.3(D)
N$72: D9.A J3.1 Q7.3(D)
N$73: D8.A J2.4 Q26.3(D)
N$74: D7.A J2.3 Q6.3(D)
N$75: D13.C R10.2
N$77: D12.C R9.2
N$78: D1.C R14.2
N$79: D2.C R16.2
N$80: D3.C R17.2
N$81: D4.C R1.2
N$82: D14.C R11.2
N$83: D15.C R12.2
N$84: D16.C R13.2
N$85: D3.A D18.C D20.A J1.3 Q3.3(D) Q23.3(D)
N$86: Q3.1(G) Q23.1(G) Q34.3(D) R38.1
N$87: Q34.1(G) U5.20(PWM13)
N$88: Q31.1(G) U5.19(PWM12)
N$89: D18.A D20.C R18.1
N$90: Q35.1(G) U5.17(PWM10)
N$91: Q11.1(G) U5.18(PWM11)
N$92: D17.A D19.C R15.1
N$93: D6.A J2.2 Q25.3(D)
N$94: D5.A J2.1 Q5.3(D)
N$95: Q5.1(G) Q11.3(D) R27.1
N$96: Q25.1(G) Q35.3(D) R46.1
N$98: D5.C R2.2
N$100: D6.C R3.2
N$139: D7.C R4.2
N$140: D8.C R5.2
N$141: D9.C R6.2
N$142: D10.C R7.2
N$146: D11.C R8.2
SCL: U5.26(SCL) ; also sheet 2,3,4,6
SDA: U5.27(SDA) ; also sheet 2,3,4,6
VBATT: Q5.2(S) Q6.2(S) Q7.2(S) Q8.2(S) Q9.2(S) Q10.2(S) Q21.2(S) Q22.2(S) Q23.2(S) Q24.2(S) Q25.2(S) Q26.2(S) Q27.2(S) Q28.2(S) Q29.2(S) Q30.2(S) R20.2 R21.2 R22.2 R23.2 R24.2 R27.2 R35.2 R36.2 R37.2 R38.2 R45.2 R46.2 R47.2 R48.2 R49.2 R50.2 ; also sheet 3,4,7

### Notes on the sheet
- addr 110 0000
- Description
  U5 is a 16-channel I2C PWM 
  generator. It combined with the top 
  row of P-CH FETs form 16 battery-
  power modulation circuits, i.e. for 12V 
  LED intensity control. 
  
  Channels 12-15 offer an additional 
  functionality, 2 full H-Bridges for DC 
  motor speed and direction control. 
  R33 and R34 are motor current sense 
  resistors for monitoring, fault 
  detection and reporting.
  
  If motor control isn't a system 
  requirement, channels 12-15 function 
  like 0-11, high-side switching.
  
  All channels have board mounted 
  power exist LED indication.
- Description
  For H-bridge operation (DC Motor), 
  populate D17-D20 instead of D1-D4. 
  D17-D20 indicate H-bridge output 
  direction.

## Sheet 6 of 7: Sensors
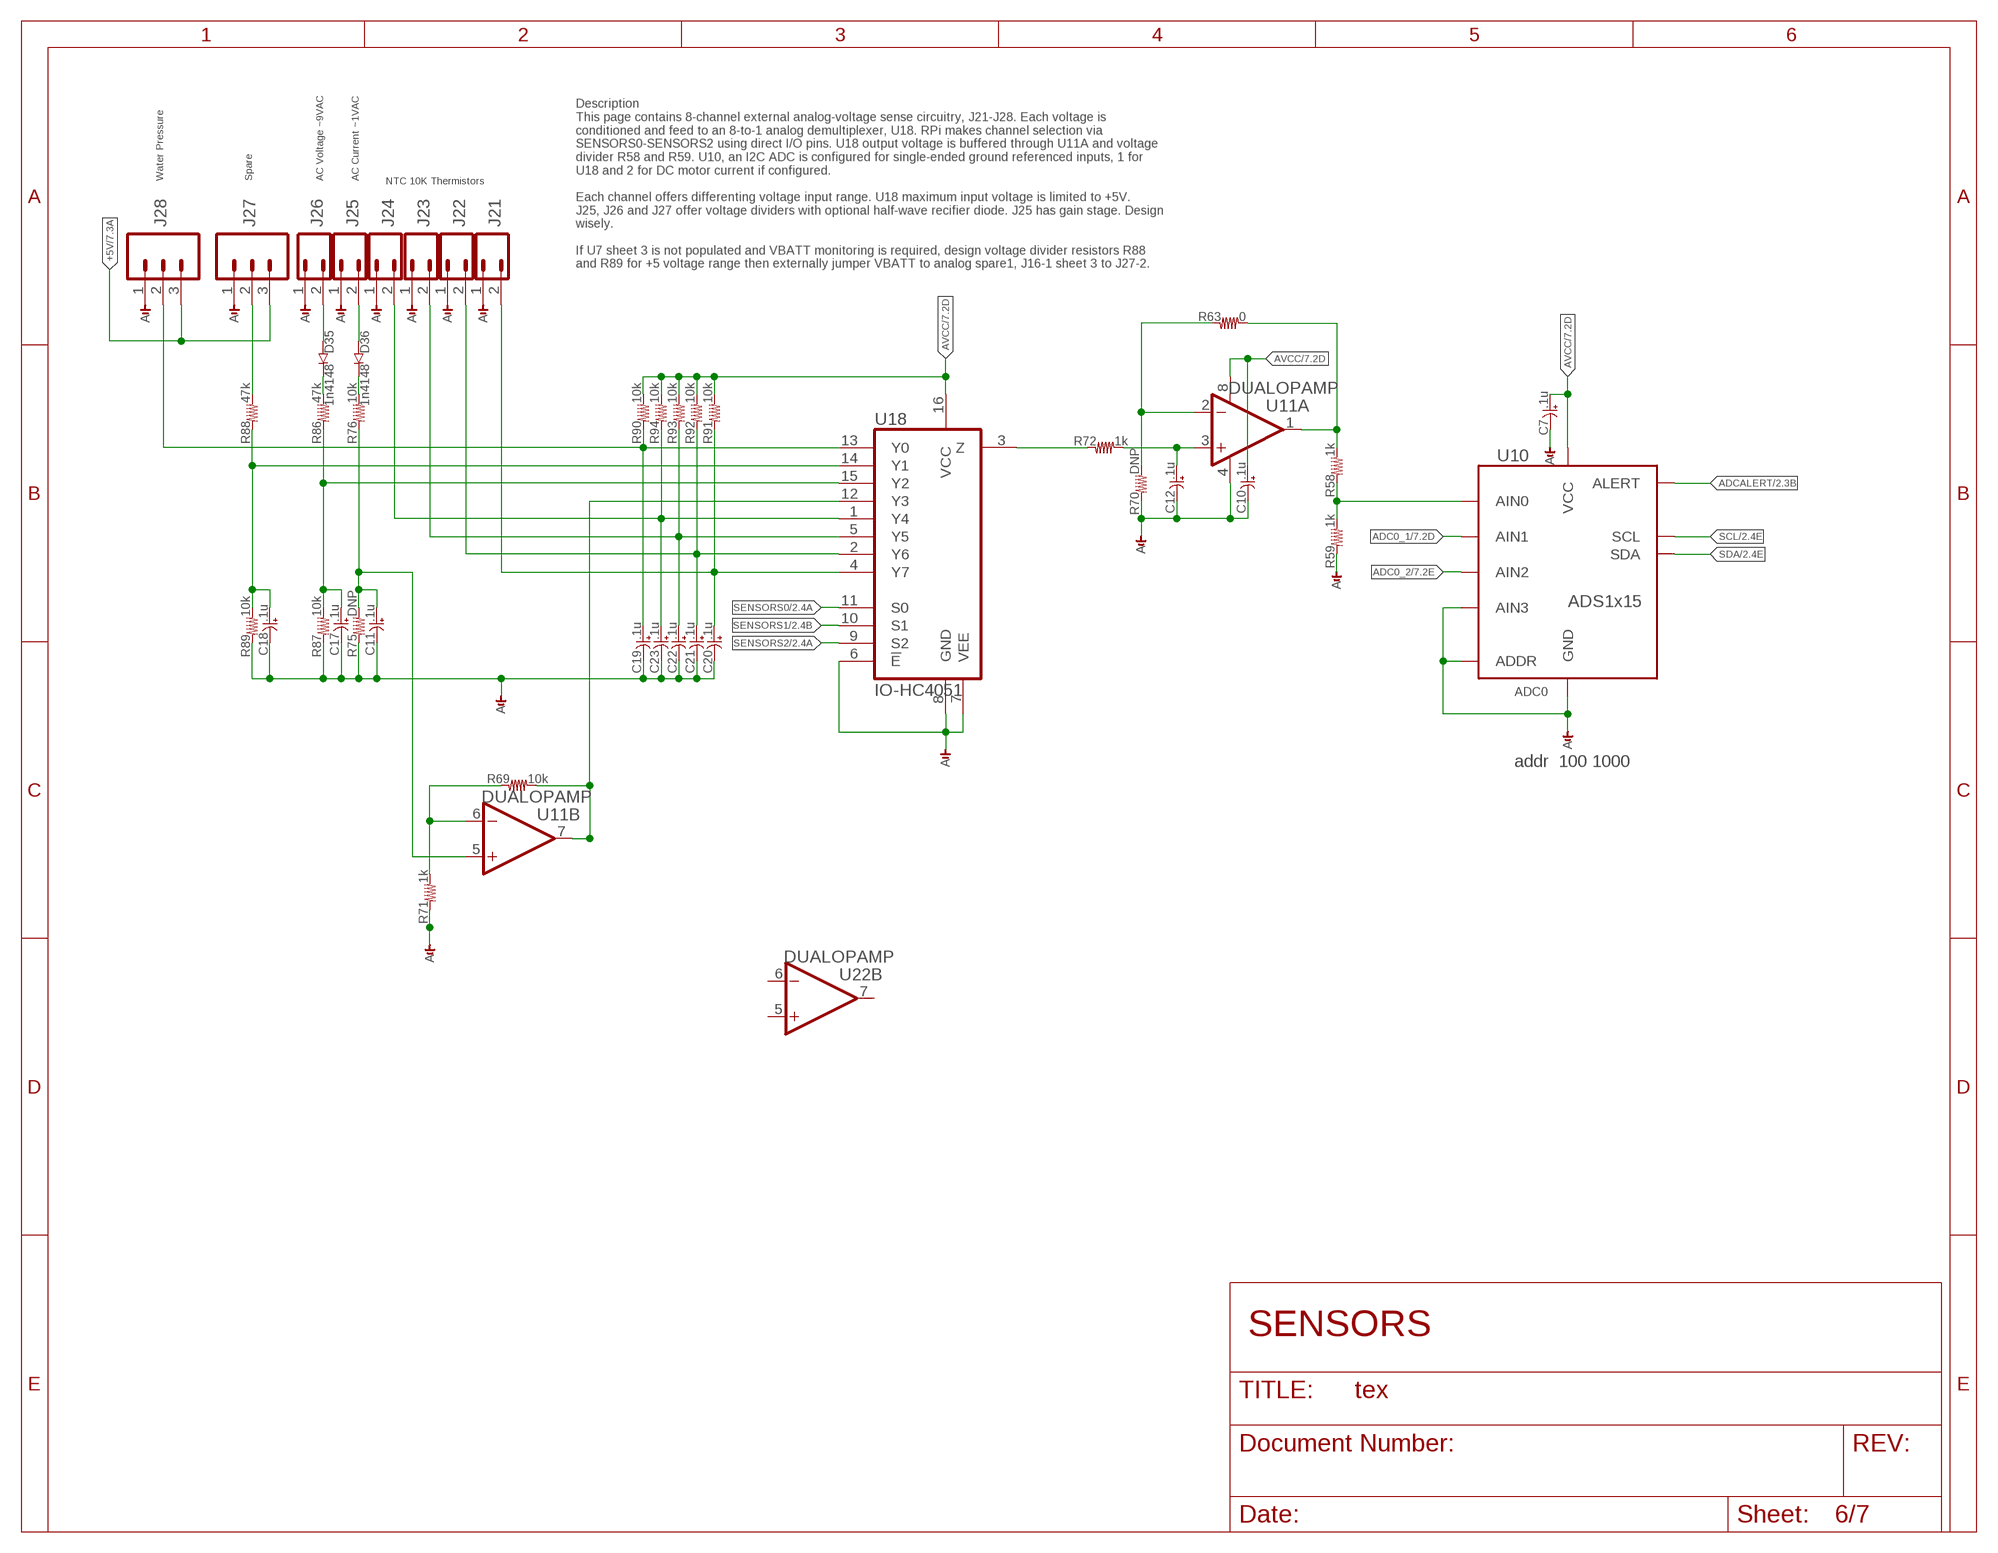
[diagram p5: schematic, sheet 6]

### Parts
C7  .1u  C-0603  [C0603]
C10  .1u  C-0603  [C0603]
C11  .1u  C-0603  [C0603]
C12  .1u  C-0603  [C0603]
C17  .1u  C-0603  [C0603]
C18  .1u  C-0603  [C0603]
C19  .1u  C-0603  [C0603]
C20  .1u  C-0603  [C0603]
C21  .1u  C-0603  [C0603]
C22  .1u  C-0603  [C0603]
C23  .1u  C-0603  [C0603]
D35  1n4148  DIODE-0603  [SOD-523]
D36  1n4148  DIODE-0603  [SOD-523]
J21  CONN-02-PLUGIN-SCREW  [CONN-3.81MM-KF2EDG-2]
J22  CONN-02-PLUGIN-SCREW  [CONN-3.81MM-KF2EDG-2]
J23  CONN-02-PLUGIN-SCREW  [CONN-3.81MM-KF2EDG-2]
J24  CONN-02-PLUGIN-SCREW  [CONN-3.81MM-KF2EDG-2]
J25  CONN-02-PLUGIN-SCREW  [CONN-3.81MM-KF2EDG-2]
J26  CONN-02-PLUGIN-SCREW  [CONN-3.81MM-KF2EDG-2]
J27  CONN-03-PLUGIN-SCREW  [CONN-3.81MM-KF2EDG-3]
J28  CONN-03-PLUGIN-SCREW  [CONN-3.81MM-KF2EDG-3]
R58  1k  R-0603  [R0603]
R59  1k  R-0603  [R0603]
R63  0  R-0603  [R0603]
R69  10k  R-0603  [R0603]
R70  DNP  R-0603  [R0603]
R71  1k  R-0603  [R0603]
R72  1k  R-0603  [R0603]
R75  DNP  R-0603  [R0603]
R76  10k  R-0603  [R0603]
R86  47k  R-0603  [R0603]
R87  10k  R-0603  [R0603]
R88  47k  R-0603  [R0603]
R89  10k  R-0603  [R0603]
R90  10k  R-0603  [R0603]
R91  10k  R-0603  [R0603]
R92  10k  R-0603  [R0603]
R93  10k  R-0603  [R0603]
R94  10k  R-0603  [R0603]
U10  ADS1x15  ADC-ADS1015-MSOP10  [MSOP10_0.5]
U11  DUALOPAMP  AMP-OPAMP-DUAL-SO08  [SO08]
U18  IO-HC4051  [SO16]
U22  DUALOPAMP  AMP-OPAMP-DUAL-SO08  [SO08]

### Nets
+5V: J27.3 J28.3 ; also sheet 2,3,4,5,7
ADC0_1: U10.5(AIN1) ; also sheet 7
ADC0_2: U10.6(AIN2) ; also sheet 7
ADCALERT: U10.2(ALERT) ; also sheet 2
AGND: C7.2 C10.2 C11.2 C12.2 C17.2 C18.2 C19.2 C20.2 C21.2 C22.2 C23.2 J21.1 J22.1 J23.1 J24.1 J25.1 J26.1 J27.1 J28.1 R59.1 R70.1 R71.1 R75.1 R87.1 R89.1 U10.1(ADDR) U10.3(GND) U10.7(AIN3) U11.4(A:V-) U18.6(!E) U18.7(VEE) U18.8(GND) ; also sheet 3,7
AVCC: C7.1 C10.1 R90.2 R91.2 R92.2 R93.2 R94.2 U10.8(VCC) U11.8(A:V+) U18.16(VCC) ; also sheet 3,7
N$2: D35.C R86.2
N$20: D35.A J26.2
N$25: D36.C R76.2
N$26: D36.A J25.2
N$27: J27.2 R88.2
N$38: R63.1 R70.2 U11.2(A:-IN)
N$39: R69.1 R71.2 U11.6(B:-IN)
N$55: C12.1 R72.2 U11.3(A:+IN)
N$120: C19.1 J28.2 R90.1 U18.13(Y0)
N$124: C18.1 R88.1 R89.2 U18.14(Y1)
N$130: C17.1 R86.1 R87.2 U18.15(Y2)
N$138: C11.1 R75.2 R76.1 U11.5(B:+IN)
N$184: C23.1 J24.2 R94.1 U18.1(Y4)
N$185: C22.1 J23.2 R93.1 U18.5(Y5)
N$186: C21.1 J22.2 R92.1 U18.2(Y6)
N$187: C20.1 J21.2 R91.1 U18.4(Y7)
N$188: R58.2 R63.2 U11.1(A:OUT)
N$189: R72.1 U18.3(Z)
N$190: R58.1 R59.2 U10.4(AIN0)
N$191: R69.2 U11.7(B:OUT) U18.12(Y3)
SCL: U10.10(SCL) ; also sheet 2,3,4,5
SDA: U10.9(SDA) ; also sheet 2,3,4,5
SENSORS0: U18.11(S0) ; also sheet 2
SENSORS1: U18.10(S1) ; also sheet 2
SENSORS2: U18.9(S2) ; also sheet 2
Unconnected: U22.1(A:OUT) U22.2(A:-IN) U22.3(A:+IN) U22.5(B:+IN) U22.6(B:-IN) U22.7(B:OUT)

### Notes on the sheet
- Description
  This page contains 8-channel external analog-voltage sense circuitry, J21-J28. Each voltage is 
  conditioned and feed to an 8-to-1 analog demultiplexer, U18. RPi makes channel selection via 
  SENSORS0-SENSORS2 using direct I/O pins. U18 output voltage is buffered through U11A and voltage 
  divider R58 and R59. U10, an I2C ADC is configured for single-ended ground referenced inputs, 1 for 
  U18 and 2 for DC motor current if configured.
  
  Each channel offers differenting voltage input range. U18 maximum input voltage is limited to +5V. 
  J25, J26 and J27 offer voltage dividers with optional half-wave recifier diode. J25 has gain stage. Design 
  wisely.
  
  If U7 sheet 3 is not populated and VBATT monitoring is required, design voltage divider resistors R88 
  and R89 for +5 voltage range then externally jumper VBATT to analog spare1, J16-1 sheet 3 to J27-2.
- Water Pressure | Spare | AC Voltage ~9VAC | AC Current ~1VAC
- NTC 10K Thermistors
- ADC0
- addr  100 1000

## Sheet 7 of 7: MOTOR
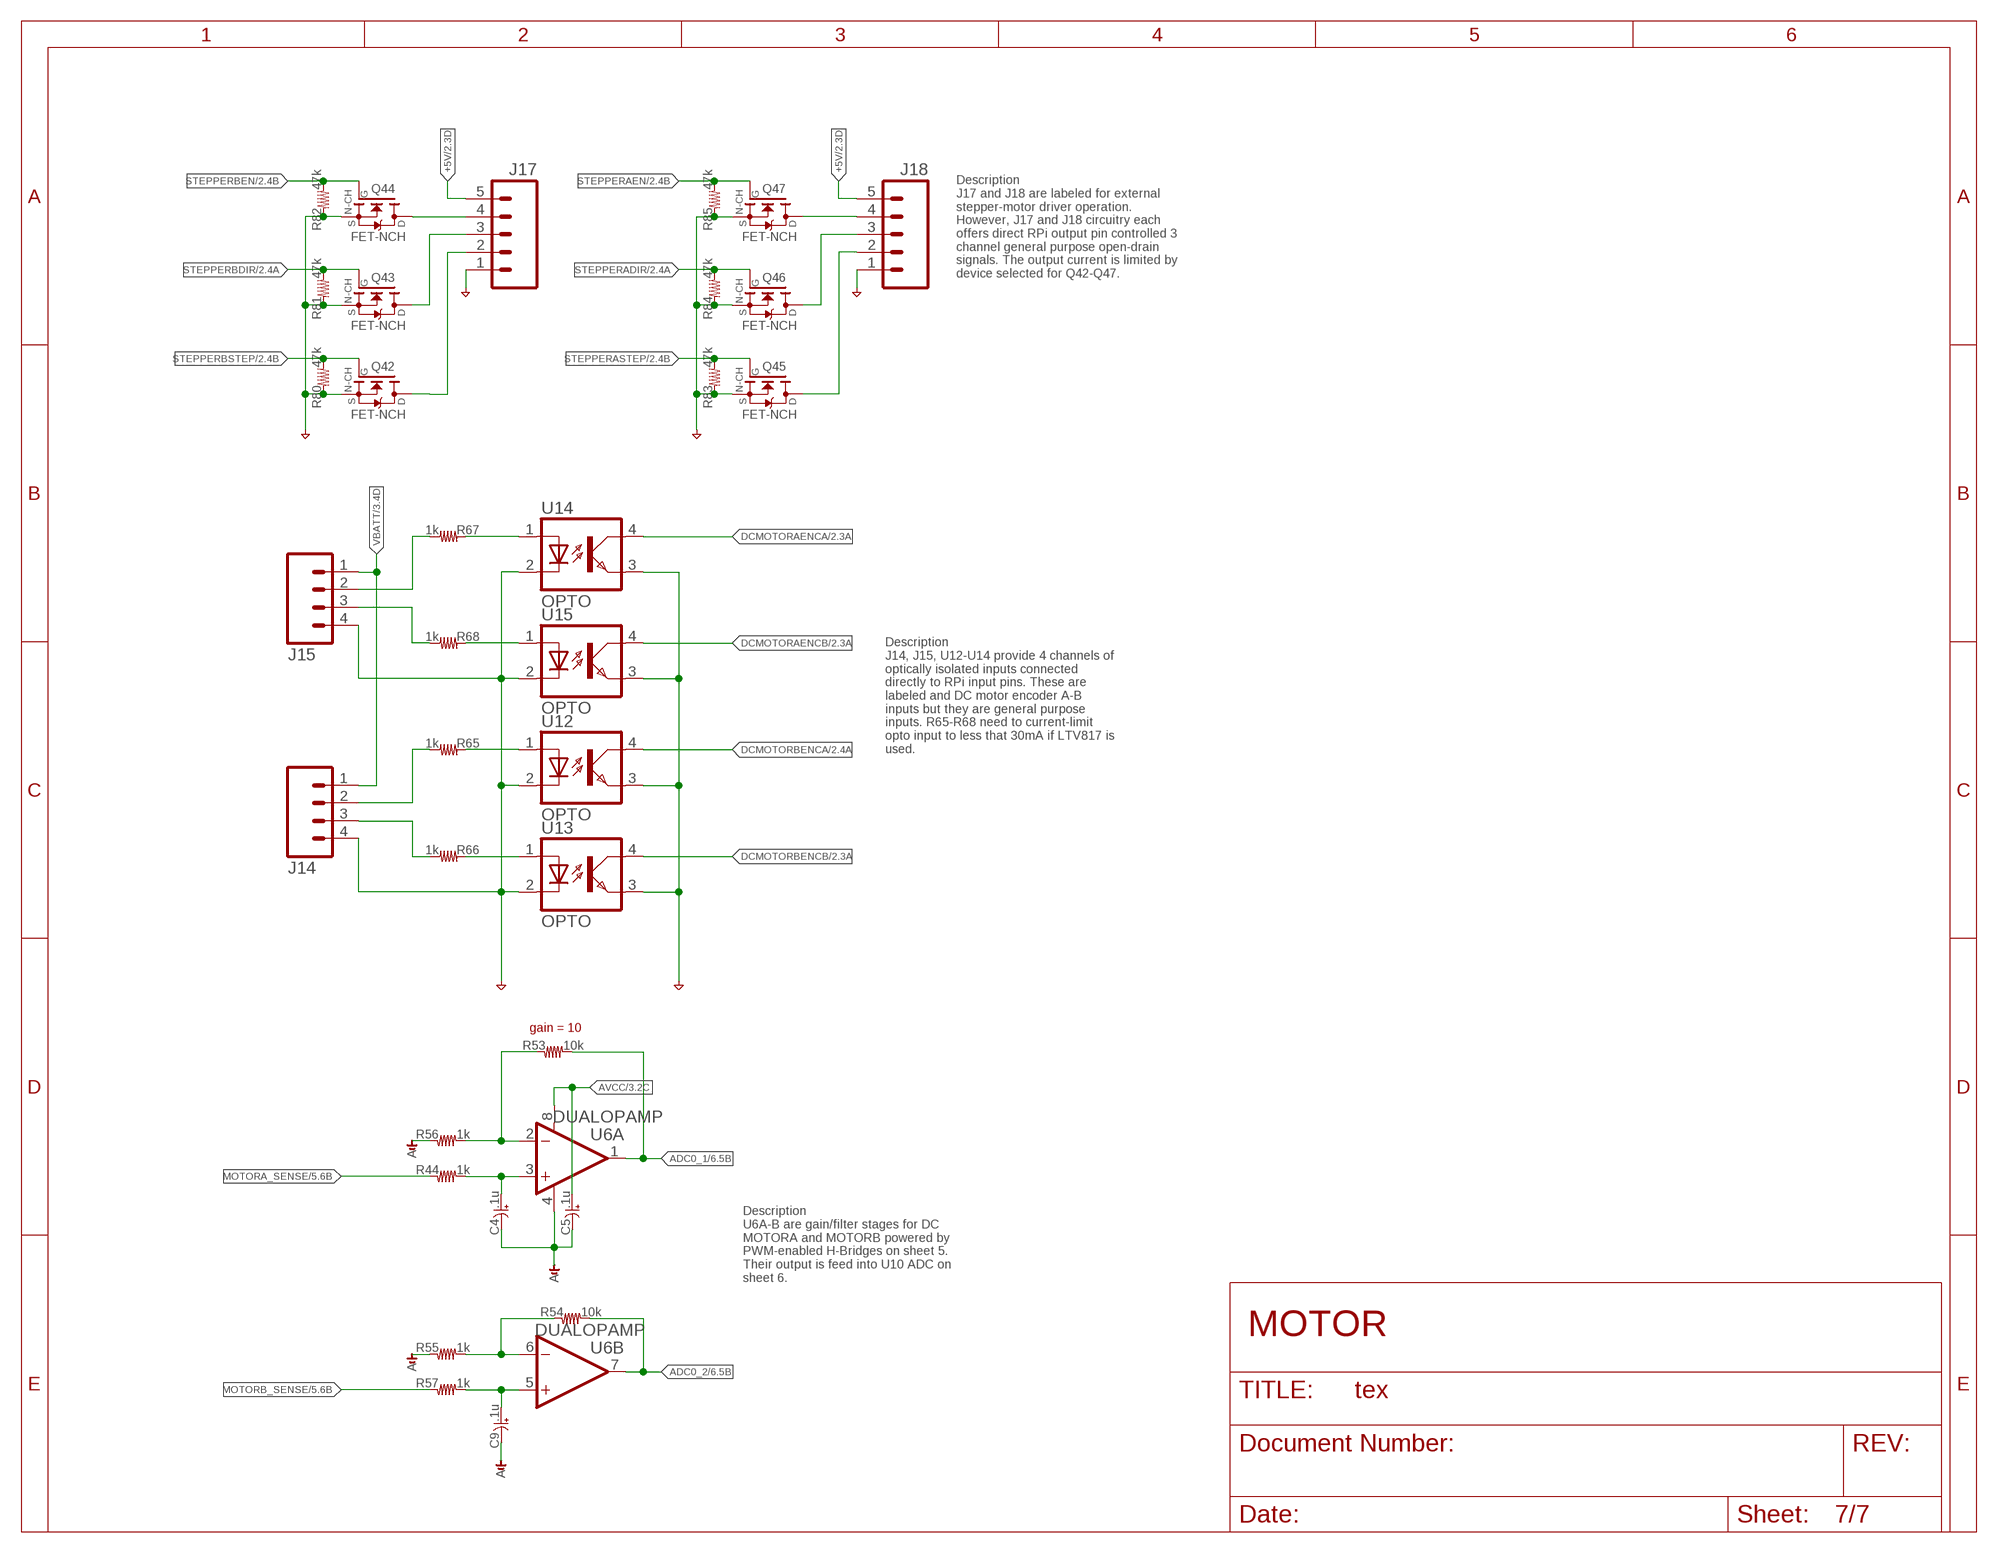
[diagram p6: schematic, sheet 7]

### Parts
C4  .1u  C-0603  [C0603]
C5  .1u  C-0603  [C0603]
C9  .1u  C-0603  [C0603]
J14  CONN-04-PLUGIN-SCREW  [CONN-3.81MM-KF2EDG-4]
J15  CONN-04-PLUGIN-SCREW  [CONN-3.81MM-KF2EDG-4]
J17  CONN-05-PLUGIN-SCREW  [CONN-3.81MM-KF2EDG-5]
J18  CONN-05-PLUGIN-SCREW  [CONN-3.81MM-KF2EDG-5]
Q42  FET-NCH  FET-NCHANNEL-SOT23  [SOT23-3]
Q43  FET-NCH  FET-NCHANNEL-SOT23  [SOT23-3]
Q44  FET-NCH  FET-NCHANNEL-SOT23  [SOT23-3]
Q45  FET-NCH  FET-NCHANNEL-SOT23  [SOT23-3]
Q46  FET-NCH  FET-NCHANNEL-SOT23  [SOT23-3]
Q47  FET-NCH  FET-NCHANNEL-SOT23  [SOT23-3]
R44  1k  R-0603  [R0603]
R53  10k  R-0603  [R0603]
R54  10k  R-0603  [R0603]
R55  1k  R-0603  [R0603]
R56  1k  R-0603  [R0603]
R57  1k  R-0603  [R0603]
R65  1k  R-0603  [R0603]
R66  1k  R-0603  [R0603]
R67  1k  R-0603  [R0603]
R68  1k  R-0603  [R0603]
R80  47k  R-0603  [R0603]
R81  47k  R-0603  [R0603]
R82  47k  R-0603  [R0603]
R83  47k  R-0603  [R0603]
R84  47k  R-0603  [R0603]
R85  47k  R-0603  [R0603]
U6  DUALOPAMP  AMP-OPAMP-DUAL-SO08  [SO08]
U12  OPTO  OPTO-LTV817  [LTV817]
U13  OPTO  OPTO-LTV817  [LTV817]
U14  OPTO  OPTO-LTV817  [LTV817]
U15  OPTO  OPTO-LTV817  [LTV817]

### Nets
+5V: J17.5 J18.5 ; also sheet 2,3,4,5,6
ADC0_1: R53.2 U6.1(A:OUT) ; also sheet 6
ADC0_2: R54.2 U6.7(B:OUT) ; also sheet 6
AGND: C4.2 C5.2 C9.2 R55.1 R56.1 U6.4(A:V-) ; also sheet 3,6
AVCC: C5.1 U6.8(A:V+) ; also sheet 3,6
DCMOTORAENCA: U14.4 ; also sheet 2
DCMOTORAENCB: U15.4 ; also sheet 2
DCMOTORBENCA: U12.4 ; also sheet 2
DCMOTORBENCB: U13.4 ; also sheet 2
GND: J14.4 J15.4 J17.1 J18.1 Q42.2(S) Q43.2(S) Q44.2(S) Q45.2(S) Q46.2(S) Q47.2(S) R80.1 R81.1 R82.1 R83.1 R84.1 R85.1 U12.2 U12.3 U13.2 U13.3 U14.2 U14.3 U15.2 U15.3 ; also sheet 2,3,4,5
MOTORA_SENSE: R44.1 ; also sheet 5
MOTORB_SENSE: R57.1 ; also sheet 5
N$97: C4.1 R44.2 U6.3(A:+IN)
N$99: R54.1 R55.2 U6.6(B:-IN)
N$105: R53.1 R56.2 U6.2(A:-IN)
N$107: C9.1 R57.2 U6.5(B:+IN)
N$148: R67.1 U14.1
N$149: J15.3 R68.2
N$150: J15.2 R67.2
N$151: J17.2 Q42.3(D)
N$152: J18.4 Q47.3(D)
N$153: J18.3 Q46.3(D)
N$154: J18.2 Q45.3(D)
N$155: R68.1 U15.1
N$156: J14.2 R65.2
N$157: J14.3 R66.2
N$158: R65.1 U12.1
N$162: R66.1 U13.1
STEPPER1DIROUT: J17.3 Q43.3(D)
STEPPER1ENOUT: J17.4 Q44.3(D)
STEPPERADIR: Q46.1(G) R84.2 ; also sheet 2
STEPPERAEN: Q47.1(G) R85.2 ; also sheet 2
STEPPERASTEP: Q45.1(G) R83.2 ; also sheet 2
STEPPERBDIR: Q43.1(G) R81.2 ; also sheet 2
STEPPERBEN: Q44.1(G) R82.2 ; also sheet 2
STEPPERBSTEP: Q42.1(G) R80.2 ; also sheet 2
VBATT: J14.1 J15.1 ; also sheet 3,4,5

### Notes on the sheet
- Description
  J17 and J18 are labeled for external 
  stepper-motor driver operation. 
  However, J17 and J18 circuitry each 
  offers direct RPi output pin controlled 3 
  channel general purpose open-drain 
  signals. The output current is limited by 
  device selected for Q42-Q47.
- Description
  J14, J15, U12-U14 provide 4 channels of 
  optically isolated inputs connected 
  directly to RPi input pins. These are 
  labeled and DC motor encoder A-B 
  inputs but they are general purpose 
  inputs. R65-R68 need to current-limit 
  opto input to less that 30mA if LTV817 is 
  used.
- gain = 10
- Description
  U6A-B are gain/filter stages for DC 
  MOTORA and MOTORB powered by 
  PWM-enabled H-Bridges on sheet 5.  
  Their output is feed into U10 ADC on 
  sheet 6.

## Power pins joined to a net without a drawn wire
V+: U22.8(A:V+)
V-: U22.4(A:V-)

## Library data of the parts
B1 = holla:CONN-COINBATTERYHOLDER
C1-C29 = holla:C; DESC: 16V Y5V -20%,+80%
D1-D20 D25-D30 D32-D34 = holla:LED
D21-D24 D31 D35 D36 = holla:DIODE
F1 = holla:FUSE-HOLDER
J1-J4 J11 J14 J15 = holla:CONN-04
J5 J6 J12 J20-J26 = holla:CONN-02: CONN HEADER 2POS
J7-J10 J27 J28 = holla:CONN-03
J13 J17 J18 = holla:CONN-05: Header 5 Standard 5-pin 0.1" header. Use with straight break away headers (SKU : PRT-00116), right angle break away headers (PRT-00553), swiss pins (PRT-00743), machine pins (PRT-00117), and female headers (PRT-00115). Molex polarized connector foot print use with SKU : PRT-08230 with associated crimp pins and housings.
J16 J19 J29 J30 = holla:CONN-06
JP1 JP3 = holla:FIDUCIAL: Fiducial Alignment Points Various fiducial points for machine vision alignment.; DNP: 1
JP2 = holla:JUMPER-PAD-2-NO
K1-K4 = holla:RELAY-SPST: Seeed 315030000 HLS8L-DC5V-S-C Alt: ORWH-SH-105D1F,000 G5LE-14 DC5
PCB1 = holla:BOARD-RPI2: Device for Raspberry Pi 2 board created by www.element14.com More information and support community is available at http://www.element14.com/community/community/raspberry-pi/raspberrypi2
Q1-Q4 Q11-Q20 Q31-Q40 Q42-Q47 = holla:FET-NCHANNEL
Q5-Q10 Q21-Q30 = holla:FET-PCHANNEL
Q41 = brightleaf:FET-PCH: P-Channel PowerTrench® MOSFET Source: FET-PCH.pdf
R1-R94 = holla:R; DESC: 5%
S1 S2 = holla:SWITCH-PUSHBUTTON
TP1 = holla:TESTPOINT; DNP: 1
U1 U2 = holla:RELAY-S108T02
U3 = holla:COMM-MAX13433E
U4 = brightleaf:AZ23CXXX: Dual Zener SOT-23
U5 = holla:IO-PCA9685: PCA9685 16-channel, 12-bit PWM Fm+ I 2 C-bus LED controller
U6 U11 U22 = holla:AMP-OPAMP-DUAL: Generic op-amp footprint
U7 = holla:ADC-INA219
U8 = holla:SENSOR-TEMP-LM75: Digital temperature sensor and thermal watchdog
U9 = holla:DCDC-CONVERTER
U10 = holla:ADC-ADS1015: Ti ADS1015 12-bit ADC Ultra-Small, Low-Power, 12-Bit Analog-to-Digital Converter with Internal Reference The ADS1013, ADS1014, and ADS1015 are precision analog-to-digital converters (ADCs) with 12 bits of resolution offered in an ultra-small, leadless QFN-10 package or an MSOP-10 package. \ Source: http://focus.ti.com/docs/prod/folders/print/ads1015.html
U12-U15 = holla:OPTO-LTV817: LiteOn OPTOISOLATOR 1CH SMD
U16 = holla:IO-MCP23017: 16-bit input/output port expander with interrupt output http://ww1.microchip.com/downloads/en/DeviceDoc/21952a.pdf Source: http://ww1.microchip.com/downloads/en/DeviceDoc/21952a.pdf; MF: MICROCHIP; MPN: MCP23017-E/SO; OC_FARNELL: 1332087; OC_NEWARK: 31K2958
U17 = holla:MEMORY-EEPROM: I2C Serial EEPROM
U18 = holla:IO-HC4051
U19 = holla:RTC-MCP7940N
U20 = holla:DISP-I2C-4PIN
Y1 = holla:CRYSTAL32-SMD: 32KHz